# EAGLE design modular_expansion_system_floppy_emulator (EAGLE 9.2.1)
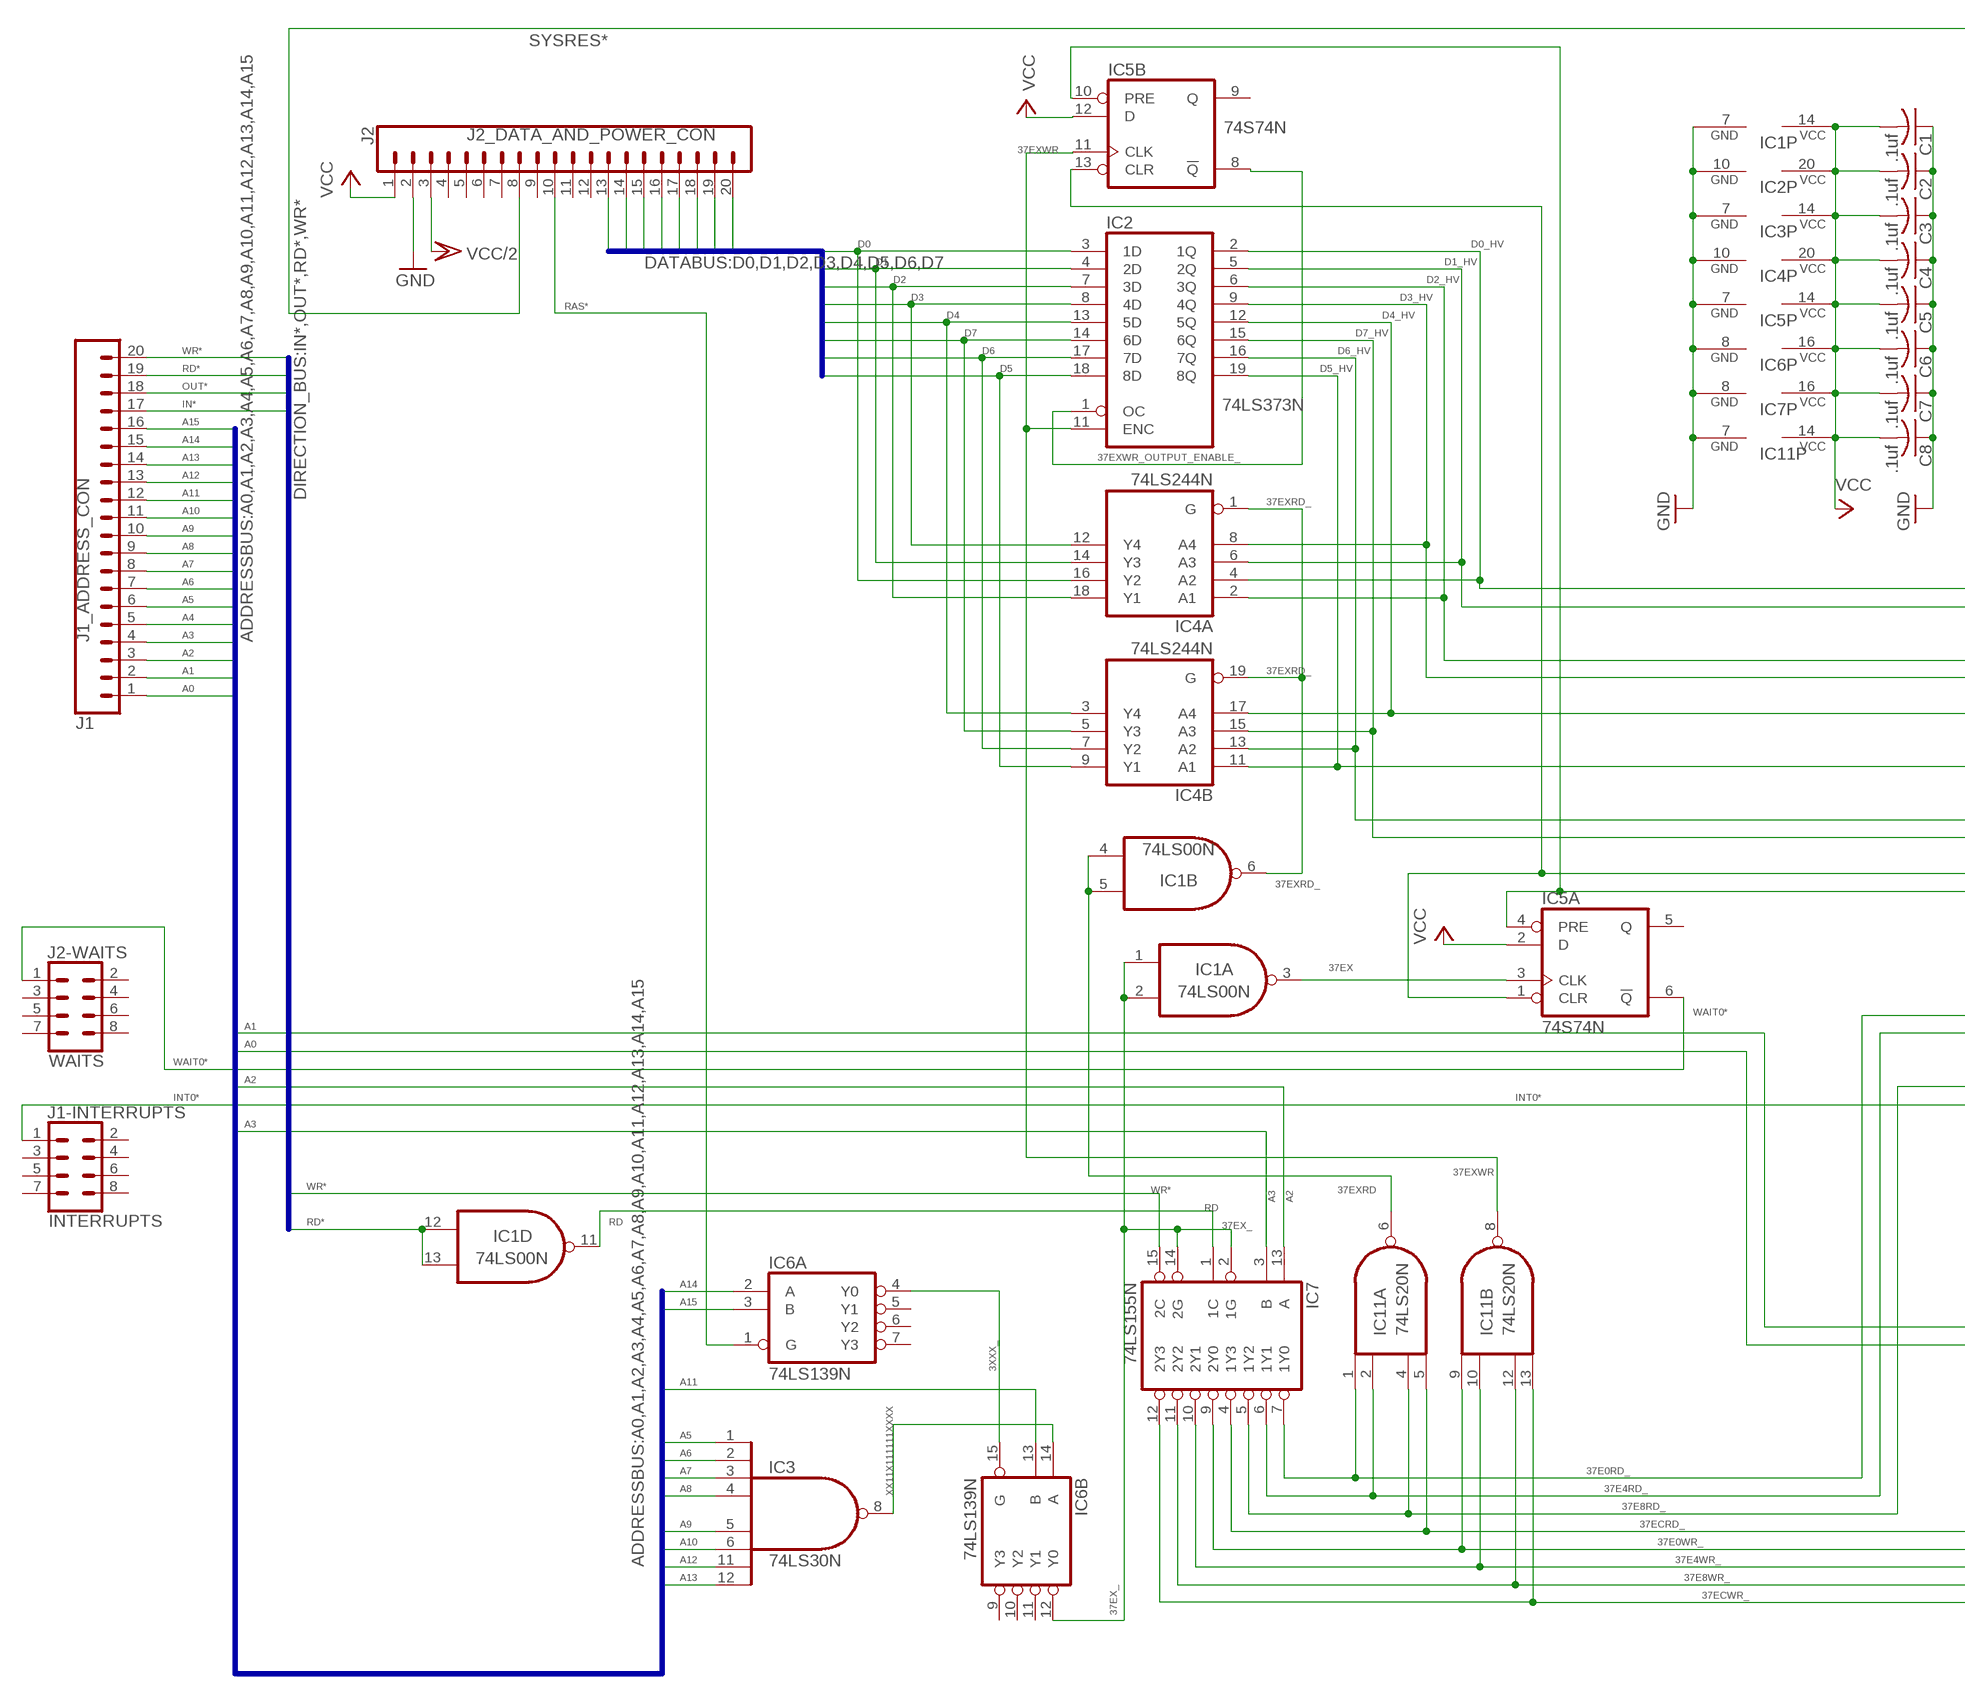
[diagram p0: schematic, sheet 1, part 1 of 2]
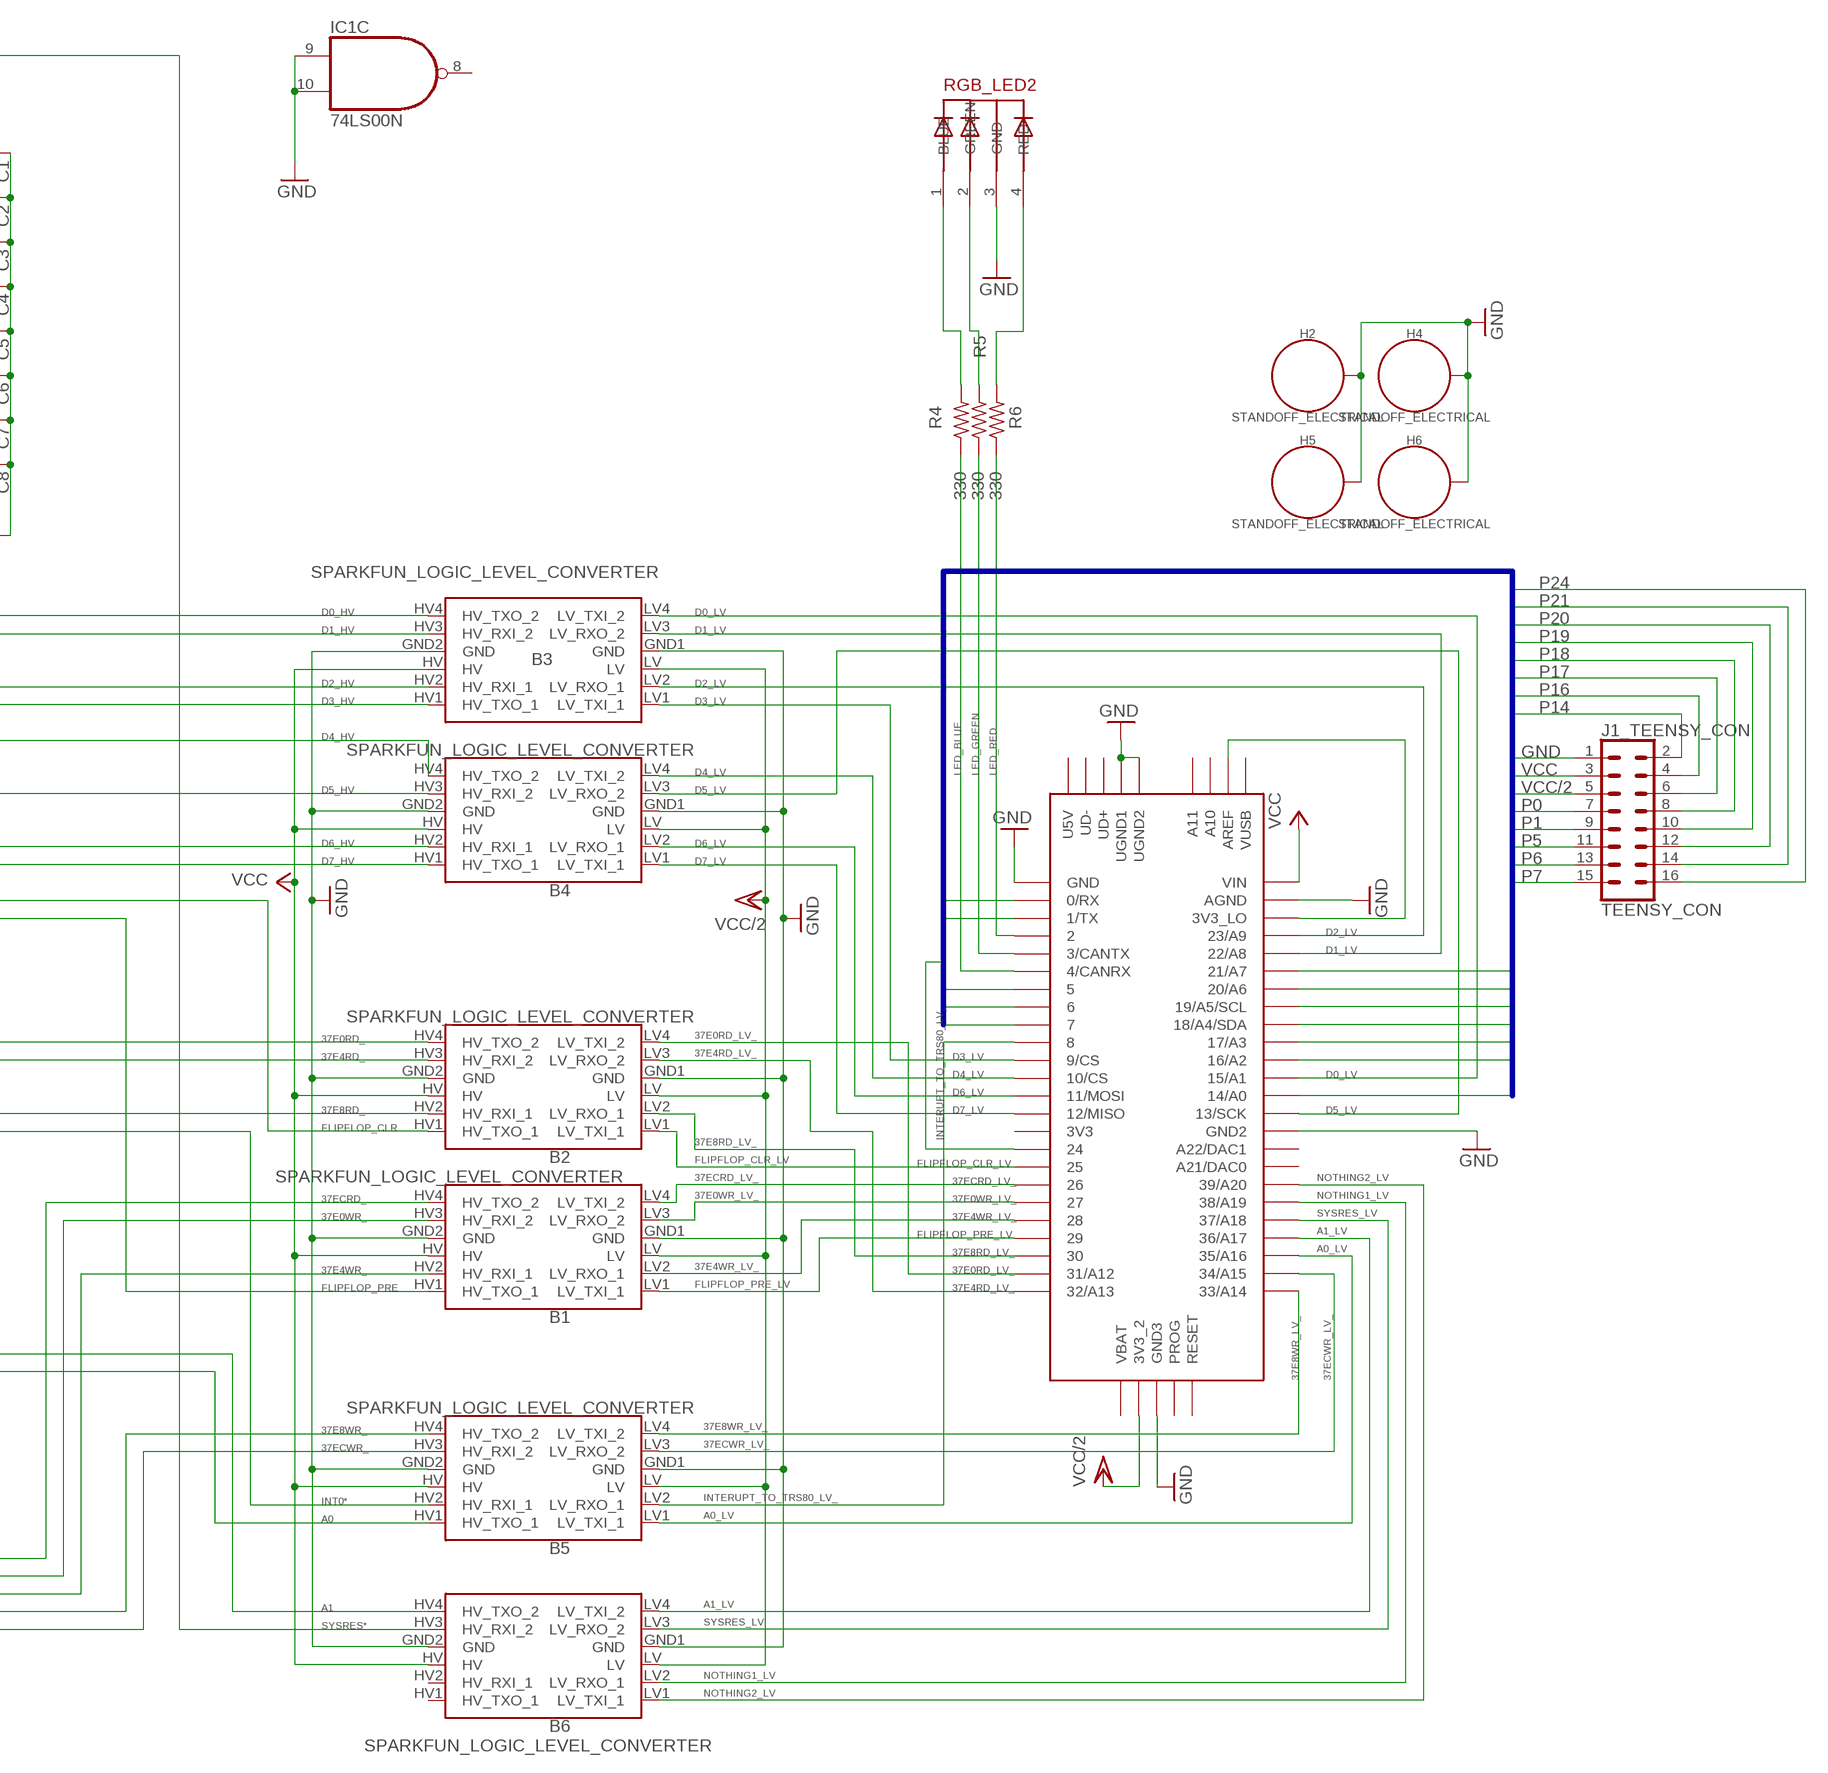
[diagram p1: schematic, sheet 1, part 2 of 2]

## Parts
B1  SPARKFUN_LOGIC_LEVEL_CONVERTER  [SPARKFUN_LOGIC_LEVEL_CONVERTER]
B2  SPARKFUN_LOGIC_LEVEL_CONVERTER  [SPARKFUN_LOGIC_LEVEL_CONVERTER]
B3  SPARKFUN_LOGIC_LEVEL_CONVERTER  [SPARKFUN_LOGIC_LEVEL_CONVERTER]
B4  SPARKFUN_LOGIC_LEVEL_CONVERTER  [SPARKFUN_LOGIC_LEVEL_CONVERTER]
B5  SPARKFUN_LOGIC_LEVEL_CONVERTER  [SPARKFUN_LOGIC_LEVEL_CONVERTER]
B6  SPARKFUN_LOGIC_LEVEL_CONVERTER  [SPARKFUN_LOGIC_LEVEL_CONVERTER]
C1  .1uf  C-US025-024X044  [C025-024X044]
C2  .1uf  C-US025-024X044  [C025-024X044]
C3  .1uf  C-US025-024X044  [C025-024X044]
C4  .1uf  C-US025-024X044  [C025-024X044]
C5  .1uf  C-US025-024X044  [C025-024X044]
C6  .1uf  C-US025-024X044  [C025-024X044]
C7  .1uf  C-US025-024X044  [C025-024X044]
C8  .1uf  C-US025-024X044  [C025-024X044]
H2  STANDOFF_ELECTRICAL  [STANDOFF-ELECTRICAL]
H4  STANDOFF_ELECTRICAL  [STANDOFF-ELECTRICAL]
H5  STANDOFF_ELECTRICAL  [STANDOFF-ELECTRICAL]
H6  STANDOFF_ELECTRICAL  [STANDOFF-ELECTRICAL]
IC1  74LS00N  [DIL14]
IC2  74LS373N  [DIL20]
IC3  74LS30N  [DIL14]
IC4  74LS244N  [DIL20]
IC5  74S74N  [DIL14]
IC6  74LS139N  [DIL16]
IC7  74LS155N  [DIL16]
IC11  74LS20N  [DIL14]
J1-INTERRUPTS  INTERRUPTS  CONN_04X2  [2X4]
J1_ADDRESS_CON  J1  CONN_20  [1X20]
J1_TEENSY_CON  TEENSY_CON  CONN_08X2  [2X8]
J2-WAITS  WAITS  CONN_04X2  [2X4]
J2_DATA_AND_POWER_CON  J2  CONN_20  [1X20]
R4  330  R-US_0204/2V  [0204V]
R5  330  R-US_0204/2V  [0204V]
R6  330  R-US_0204/2V  [0204V]
RGB_LED2  5MMRGBLED  [LED5MMRGB]
U$2  TEENSY_3.5/3.6  [TEENSY_3.5/3.6]

## Nets
3XXX_: IC6.4(A:Y0) IC6.15(B:G)
37E0RD_: B2.HV4(HV_TXO_2) IC7.7(1Y0) IC11.1(A:I0)
37E0RD_LV_: B2.LV4(LV_TXI_2) U$2.31/A12
37E0WR_: B1.HV3(HV_RXI_2) IC7.9(2Y0) IC11.9(B:I0)
37E0WR_LV_: B1.LV3(LV_RXO_2) U$2.27
37E4RD_: B2.HV3(HV_RXI_2) IC7.6(1Y1) IC11.2(A:I1)
37E4RD_LV_: B2.LV3(LV_RXO_2) U$2.32/A13
37E4WR_: B1.HV2(HV_RXI_1) IC7.10(2Y1) IC11.10(B:I1)
37E4WR_LV_: B1.LV2(LV_RXO_1) U$2.28
37E8RD_: B2.HV2(HV_RXI_1) IC7.5(1Y2) IC11.4(A:I2)
37E8RD_LV_: B2.LV2(LV_RXO_1) U$2.30
37E8WR_: B5.HV4(HV_TXO_2) IC7.11(2Y2) IC11.12(B:I2)
37E8WR_LV_: B5.LV4(LV_TXI_2) U$2.33/A14
37ECRD_: B1.HV4(HV_TXO_2) IC7.4(1Y3) IC11.5(A:I3)
37ECRD_LV_: B1.LV4(LV_TXI_2) U$2.26
37ECWR_: B5.HV3(HV_RXI_2) IC7.12(2Y3) IC11.13(B:I3)
37ECWR_LV_: B5.LV3(LV_RXO_2) U$2.34/A15
37EX: IC1.3(A:O) IC5.3(A:CLK)
37EX_: IC1.1(A:I0) IC1.2(A:I1) IC6.12(B:Y0) IC7.2(1G) IC7.14(2G)
37EXRD: IC1.4(B:I0) IC1.5(B:I1) IC11.6(A:O)
37EXRD_: IC1.6(B:O) IC4.1(A:G) IC4.19(B:G)
37EXWR: IC2.11(ENC) IC5.11(B:CLK) IC11.8(B:O)
37EXWR_OUTPUT_ENABLE_: IC2.1(OC) IC5.8(B:!Q)
A0: B5.HV1(HV_TXO_1) J1_ADDRESS_CON.1
A0_LV: B5.LV1(LV_TXI_1) U$2.35/A16
A1: B6.HV4(HV_TXO_2) J1_ADDRESS_CON.2
A1_LV: B6.LV4(LV_TXI_2) U$2.36/A17
A2: IC7.13(A) J1_ADDRESS_CON.3
A3: IC7.3(B) J1_ADDRESS_CON.4
A4: J1_ADDRESS_CON.5
A5: IC3.1(I0) J1_ADDRESS_CON.6
A6: IC3.2(I1) J1_ADDRESS_CON.7
A7: IC3.3(I2) J1_ADDRESS_CON.8
A8: IC3.4(I3) J1_ADDRESS_CON.9
A9: IC3.5(I4) J1_ADDRESS_CON.10
A10: IC3.6(I5) J1_ADDRESS_CON.11
A11: IC6.13(B:B) J1_ADDRESS_CON.12
A12: IC3.11(I6) J1_ADDRESS_CON.13
A13: IC3.12(I7) J1_ADDRESS_CON.14
A14: IC6.2(A:A) J1_ADDRESS_CON.15
A15: IC6.3(A:B) J1_ADDRESS_CON.16
D0: IC2.3(1D) IC4.16(A:Y2) J2_DATA_AND_POWER_CON.20
D0_HV: B3.HV4(HV_TXO_2) IC2.2(1Q) IC4.4(A:A2)
D0_LV: B3.LV4(LV_TXI_2) U$2.15/A1
D1: IC2.4(2D) IC4.14(A:Y3) J2_DATA_AND_POWER_CON.19
D1_HV: B3.HV3(HV_RXI_2) IC2.5(2Q) IC4.6(A:A3)
D1_LV: B3.LV3(LV_RXO_2) U$2.22/A8
D2: IC2.7(3D) IC4.18(A:Y1) J2_DATA_AND_POWER_CON.18
D2_HV: B3.HV2(HV_RXI_1) IC2.6(3Q) IC4.2(A:A1)
D2_LV: B3.LV2(LV_RXO_1) U$2.23/A9
D3: IC2.8(4D) IC4.12(A:Y4) J2_DATA_AND_POWER_CON.17
D3_HV: B3.HV1(HV_TXO_1) IC2.9(4Q) IC4.8(A:A4)
D3_LV: B3.LV1(LV_TXI_1) U$2.9/CS
D4: IC2.13(5D) IC4.3(B:Y4) J2_DATA_AND_POWER_CON.16
D4_HV: B4.HV4(HV_TXO_2) IC2.12(5Q) IC4.17(B:A4)
D4_LV: B4.LV4(LV_TXI_2) U$2.10/CS
D5: IC2.18(8D) IC4.9(B:Y1) J2_DATA_AND_POWER_CON.15
D5_HV: B4.HV3(HV_RXI_2) IC2.19(8Q) IC4.11(B:A1)
D5_LV: B4.LV3(LV_RXO_2) U$2.13/SCK
D6: IC2.17(7D) IC4.7(B:Y2) J2_DATA_AND_POWER_CON.14
D6_HV: B4.HV2(HV_RXI_1) IC2.16(7Q) IC4.13(B:A2)
D6_LV: B4.LV2(LV_RXO_1) U$2.11/MOSI
D7: IC2.14(6D) IC4.5(B:Y3) J2_DATA_AND_POWER_CON.13
D7_HV: B4.HV1(HV_TXO_1) IC2.15(6Q) IC4.15(B:A3)
D7_LV: B4.LV1(LV_TXI_1) U$2.12/MISO
FLIPFLOP_CLR: B2.HV1(HV_TXO_1) IC5.1(A:CLR) IC5.13(B:CLR)
FLIPFLOP_CLR_LV: B2.LV1(LV_TXI_1) U$2.25
FLIPFLOP_PRE: B1.HV1(HV_TXO_1) IC5.4(A:PRE) IC5.10(B:PRE)
FLIPFLOP_PRE_LV: B1.LV1(LV_TXI_1) U$2.29
GND: B1.GND1(GND) B1.GND2(GND) B2.GND1(GND) B2.GND2(GND) B3.GND1(GND) B3.GND2(GND) B4.GND1(GND) B4.GND2(GND) B5.GND1(GND) B5.GND2(GND) B6.GND1(GND) B6.GND2(GND) C1.1 C2.1 C3.1 C4.1 C5.1 C6.1 C7.1 C8.1 H2.P1 H4.P1 H5.P1 H6.P1 IC1.7(P:GND) IC1.9(C:I0) IC1.10(C:I1) IC2.10(GND) IC3.7(GND) IC4.10(P:GND) IC5.7(P:GND) IC6.8(P:GND) IC7.8(GND) IC11.7(P:GND) J1_TEENSY_CON.1 J2_DATA_AND_POWER_CON.2 RGB_LED2.3(GND) U$2.AGND U$2.GND U$2.GND2 U$2.GND3 U$2.UGND1 U$2.UGND2
IN*: J1_ADDRESS_CON.17
INT0*: B5.HV2(HV_RXI_1) J1-INTERRUPTS.1
INTERUPT_TO_TRS80_LV_: B5.LV2(LV_RXO_1) U$2.8
LED_BLUE: R4.1 U$2.4/CANRX
LED_GREEN: R5.1 U$2.3/CANTX
LED_RED: R6.1 U$2.2
N$1: U$2.3V3_LO U$2.AREF
N$2: R5.2 RGB_LED2.2(GREEN)
N$19: R4.2 RGB_LED2.1(BLUE)
N$21: R6.2 RGB_LED2.4(RED)
NOTHING1_LV: B6.LV2(LV_RXO_1) U$2.38/A19
NOTHING2_LV: B6.LV1(LV_TXI_1) U$2.39/A20
OUT*: J1_ADDRESS_CON.18
P0: J1_TEENSY_CON.7 U$2.0/RX
P1: J1_TEENSY_CON.9 U$2.1/TX
P5: J1_TEENSY_CON.11 U$2.5
P6: J1_TEENSY_CON.13 U$2.6
P7: J1_TEENSY_CON.15 U$2.7
P14: J1_TEENSY_CON.2 U$2.14/A0
P16: J1_TEENSY_CON.4 U$2.16/A2
P17: J1_TEENSY_CON.6 U$2.17/A3
P18: J1_TEENSY_CON.8 U$2.18/A4/SDA
P19: J1_TEENSY_CON.10 U$2.19/A5/SCL
P20: J1_TEENSY_CON.12 U$2.20/A6
P21: J1_TEENSY_CON.14 U$2.21/A7
P24: J1_TEENSY_CON.16 U$2.24
RAS*: IC6.1(A:G) J2_DATA_AND_POWER_CON.10
RD: IC1.11(D:O) IC7.1(1C)
RD*: IC1.12(D:I0) IC1.13(D:I1) J1_ADDRESS_CON.19
SYSRES*: B6.HV3(HV_RXI_2) J2_DATA_AND_POWER_CON.8
SYSRES_LV: B6.LV3(LV_RXO_2) U$2.37/A18
VCC: B1.HV B2.HV B3.HV B4.HV B5.HV B6.HV C1.2 C2.2 C3.2 C4.2 C5.2 C6.2 C7.2 C8.2 IC1.14(P:VCC) IC2.20(VCC) IC3.14(VCC) IC4.20(P:VCC) IC5.2(A:D) IC5.12(B:D) IC5.14(P:VCC) IC6.16(P:VCC) IC7.16(VCC) IC11.14(P:VCC) J1_TEENSY_CON.3 J2_DATA_AND_POWER_CON.1 U$2.VIN
VCC/2: B1.LV B2.LV B3.LV B4.LV B5.LV B6.LV J1_TEENSY_CON.5 J2_DATA_AND_POWER_CON.3 U$2.3V3_2
WAIT0*: IC5.6(A:!Q) J2-WAITS.1
WR*: IC7.15(2C) J1_ADDRESS_CON.20
XX11X111111XXXX: IC3.8(O) IC6.14(B:A)
Unconnected: B6.HV1(HV_TXO_1) B6.HV2(HV_RXI_1) IC1.8(C:O) IC5.5(A:Q) IC5.9(B:Q) IC6.5(A:Y1) IC6.6(A:Y2) IC6.7(A:Y3) IC6.9(B:Y3) IC6.10(B:Y2) IC6.11(B:Y1) J1-INTERRUPTS.2 J1-INTERRUPTS.3 J1-INTERRUPTS.4 J1-INTERRUPTS.5 J1-INTERRUPTS.6 J1-INTERRUPTS.7 J1-INTERRUPTS.8 J2-WAITS.2 J2-WAITS.3 J2-WAITS.4 J2-WAITS.5 J2-WAITS.6 J2-WAITS.7 J2-WAITS.8 J2_DATA_AND_POWER_CON.4 J2_DATA_AND_POWER_CON.5 J2_DATA_AND_POWER_CON.6 J2_DATA_AND_POWER_CON.7 J2_DATA_AND_POWER_CON.9 J2_DATA_AND_POWER_CON.11 J2_DATA_AND_POWER_CON.12 U$2.3V3 U$2.21/DAC0(A21/DAC0) U$2.A10 U$2.A11 U$2.A22/DAC1 U$2.PROG U$2.RESET U$2.U5V U$2.UD+ U$2.UD- U$2.VBAT U$2.VUSB

## Buses
ADDRESSBUS:A0,A1,A2,A3,A4,A5,A6,A7,A8,A9,A10,A11,A12,A13,A14,A15
DIRECTION_BUS:IN*,OUT*,RD*,WR*
DATABUS:D0,D1,D2,D3,D4,D5,D6,D7
TEENSY_UNUSED:GND,P0,P1,P5,P6,P7,P14,P16,P17,P18,P19,P20,P21,P24,VCC,VCC/2

## Library data of the parts
B1-B6 = SparkFun-Boards:SPARKFUN_LOGIC_LEVEL_CONVERTER: SparkFun Logic Level Converter -Bi-Directional This is the mechnical outline for the 3.3V - 5V bi directional logic level converter. *Note, the "LOCK" Package has the header pins staggered by an offset of 5 mils (off center line), so that when you slide a row of standard 0.1" headers into the PTH pads, it will hold position vertically. See the follwing turorial for more information on this type of special footprints: Sneaky Footprints <https://www.sparkfun.com/tutorials/114> SparkFun Products: SparkFun Logic Level Converter - Bi-Directional <https://www.sparkfun.com/products/12009>
C1-C8 = rcl:C-US: CAPACITOR, American symbol; SPICEPREFIX: C
H2 H4-H6 = SparkFun-Hardware:STANDOFF_ELECTRICAL: Stand Off Drill holes with an electrical connection. For example, use these to ground your board to a chassis. Example SparkFun Products Screw - Phillips Head (1/4", 4-40, 10 pack) <https://www.sparkfun.com/products/10453> (PRT-10453) Screw - Phillips Head (1/2", 4-40, 10 pack) <https://www.sparkfun.com/products/10452> (PRT-10452) Screw - Phillips Head (3/4", 4-40, 10 pack) <https://www.sparkfun.com/products/10451> (PRT-10451) Screw - Phillips Head (1", 4-40, 10 pack) <https://www.sparkfun.com/products/10450> (PRT-10450)
IC1 = 74xx-us:74*00: Quad 2-input NAND gate
IC2 = 74xx-us:74*373: Octal D type transparent LATCH, edge triggered
IC3 = 74xx-us:74*30: 8-input NAND gate
IC4 = 74xx-us:74*244: Octal BUFFER and LINE DRIVER, 3-state
IC5 = 74xx-us:74*74: Dual D type positive edge triggered FLIP FLOP, preset and clear
IC6 = 74xx-us:74*139: Dual 2-line to 4-line DECODER/DEMULTIPLEXER
IC7 = 74xx-us:74*155: Dual 2-line to 4-line data DECODER/DEMULTIPLEXER
IC11 = 74xx-us:74*20: Dual 4-input NAND gate
J1-INTERRUPTS J2-WAITS = SparkFun-Connectors:CONN_04X2: Multi connection point. Often used as Generic Header-pin footprint for 0.1 inch spaced/style header connections On any of the 0.1 inch spaced packages, you can populate with these: Break Away Headers - Straight <https://www.sparkfun.com/products/116> (PRT-00116) Break Away Male Headers - Right Angle <https://www.sparkfun.com/products/553> (PRT-00553) Female Headers <https://www.sparkfun.com/products/115> (PRT-00115) Break Away Headers - Machine Pin <https://www.sparkfun.com/products/117> (PRT-00117) Break Away Female Headers - Swiss Machine Pin <https://www.sparkfun.com/products/743> (PRT-00743)
J1_ADDRESS_CON J2_DATA_AND_POWER_CON = SparkFun-Connectors:CONN_20: Multi connection point. Often used as Generic Header-pin footprint for 0.1 inch spaced/style header connections On any of the 0.1 inch spaced packages, you can populate with these: Break Away Headers - Straight <https://www.sparkfun.com/products/116> (PRT-00116) Break Away Male Headers - Right Angle <https://www.sparkfun.com/products/553> (PRT-00553) Female Headers <https://www.sparkfun.com/products/115> (PRT-00115) Break Away Headers - Machine Pin <https://www.sparkfun.com/products/117> (PRT-00117) Break Away Female Headers - Swiss Machine Pin <https://www.sparkfun.com/products/743> (PRT-00743) For SCREWTERMINALS and SPRING TERMINALS visit here: Screw Terimnals on SparkFun.com <https://www.sparkfun.com/search/results?term=Screw+Terminals> (5mm/3.5mm/2.54mm spacing) This device is also useful as a general connection point to wire up your design to another part of your project. Our various solder wires solder well into these plated through hole pads. Hook-Up Wire - Assortment (Stranded, 22 AWG) <https://www.sparkfun.com/products/11375> (PRT-11375) Hook-Up Wire - Assortment (Solid Core, 22 AWG) <https://www.sparkfun.com/products/11367> (PRT-11367) View the entire wire category on our website here <https://www.sparkfun.com/categories/141> Special notes: Molex polarized connector foot print use with SKU : PRT-08231 with associated crimp pins and housings. 1MM SMD Version SKU: PRT-10208 NOTES ON THE VARIANTS LOCK and LOCK_LONGPADS... This footprint was designed to help hold the alignment of a through-hole component (i.e. 6-pin header) while soldering it into place. You may notice that each hole has been shifted either up or down by 0.005 of an inch from it's more standard position (which is a perfectly straight line). This slight alteration caused the pins (the squares in the middle) to touch the edges of the holes. Because they are alternating, it causes a "brace" to hold the component in place. 0.005 has proven to be the perfect amount of "off-center" position when using our standard breakaway headers. Although looks a little odd when you look at the bare footprint, once you have a header in there, the alteration is very hard to notice. Also,if you push a header all the way into place, it is covered up entirely on the bottom side. Note about LOCK SPECIAL package: This is just like the LOCK variant in that the holes are staggared by 5 mil, but except for the last two holes. They are not altered from the "standard" footprint layout. This is used for a special purpose on the layout of our Graphic LCD Backpack. Make sure you want to use this device before selecting it for you project!
J1_TEENSY_CON = SparkFun-Connectors:CONN_08X2: Multi connection point. Often used as Generic Header-pin footprint for 0.1 inch spaced/style header connections You can populate with any combo of single row headers, but if you'd like an exact match, check this: Header - 2x8 (Male, 0.1") <https://www.sparkfun.com/products/13156> (PRT-13156) On any of the 0.1 inch spaced packages, you can populate with these: Break Away Headers - Straight <https://www.sparkfun.com/products/116> (PRT-00116) Break Away Male Headers - Right Angle <https://www.sparkfun.com/products/553> (PRT-00553) Female Headers <https://www.sparkfun.com/products/115> (PRT-00115) Break Away Headers - Machine Pin <https://www.sparkfun.com/products/117> (PRT-00117) Break Away Female Headers - Swiss Machine Pin <https://www.sparkfun.com/products/743> (PRT-00743)
R4-R6 = resistor:R-US_: RESISTOR, American symbol
RGB_LED2 = adafruit:5MMRGBLED
U$2 = Teensy356:TEENSY_3.5/3.6

## Net classes
0 default: width 0.3 mm, clearance 0.05 mm

## Board
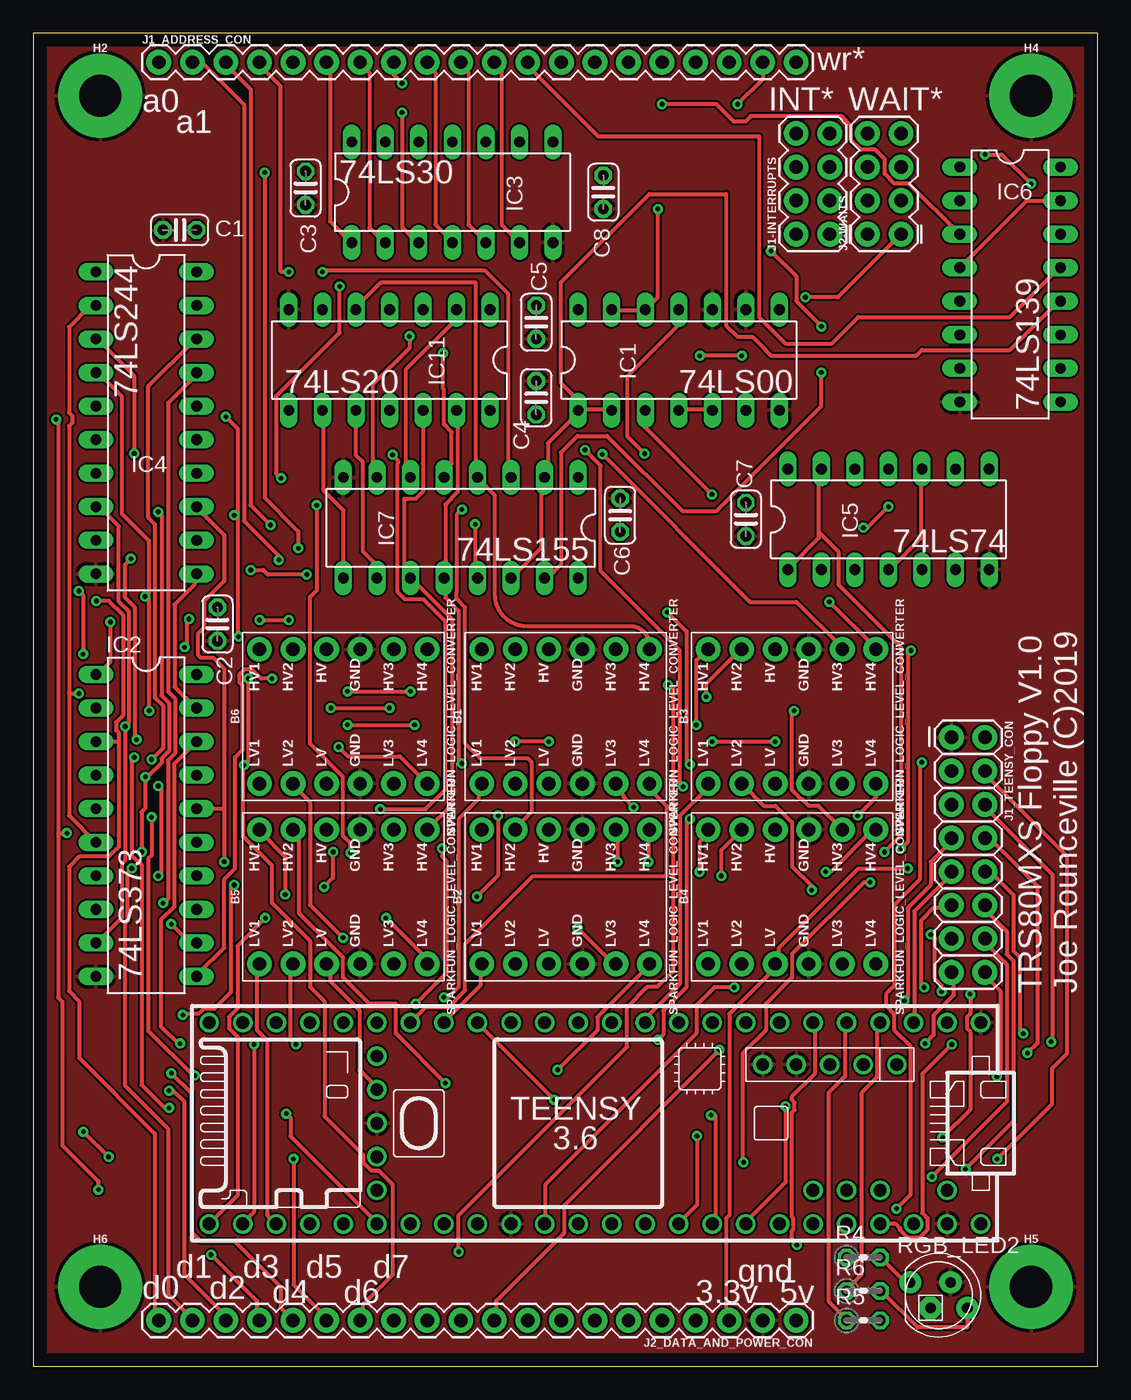
[diagram p2: board, top side]
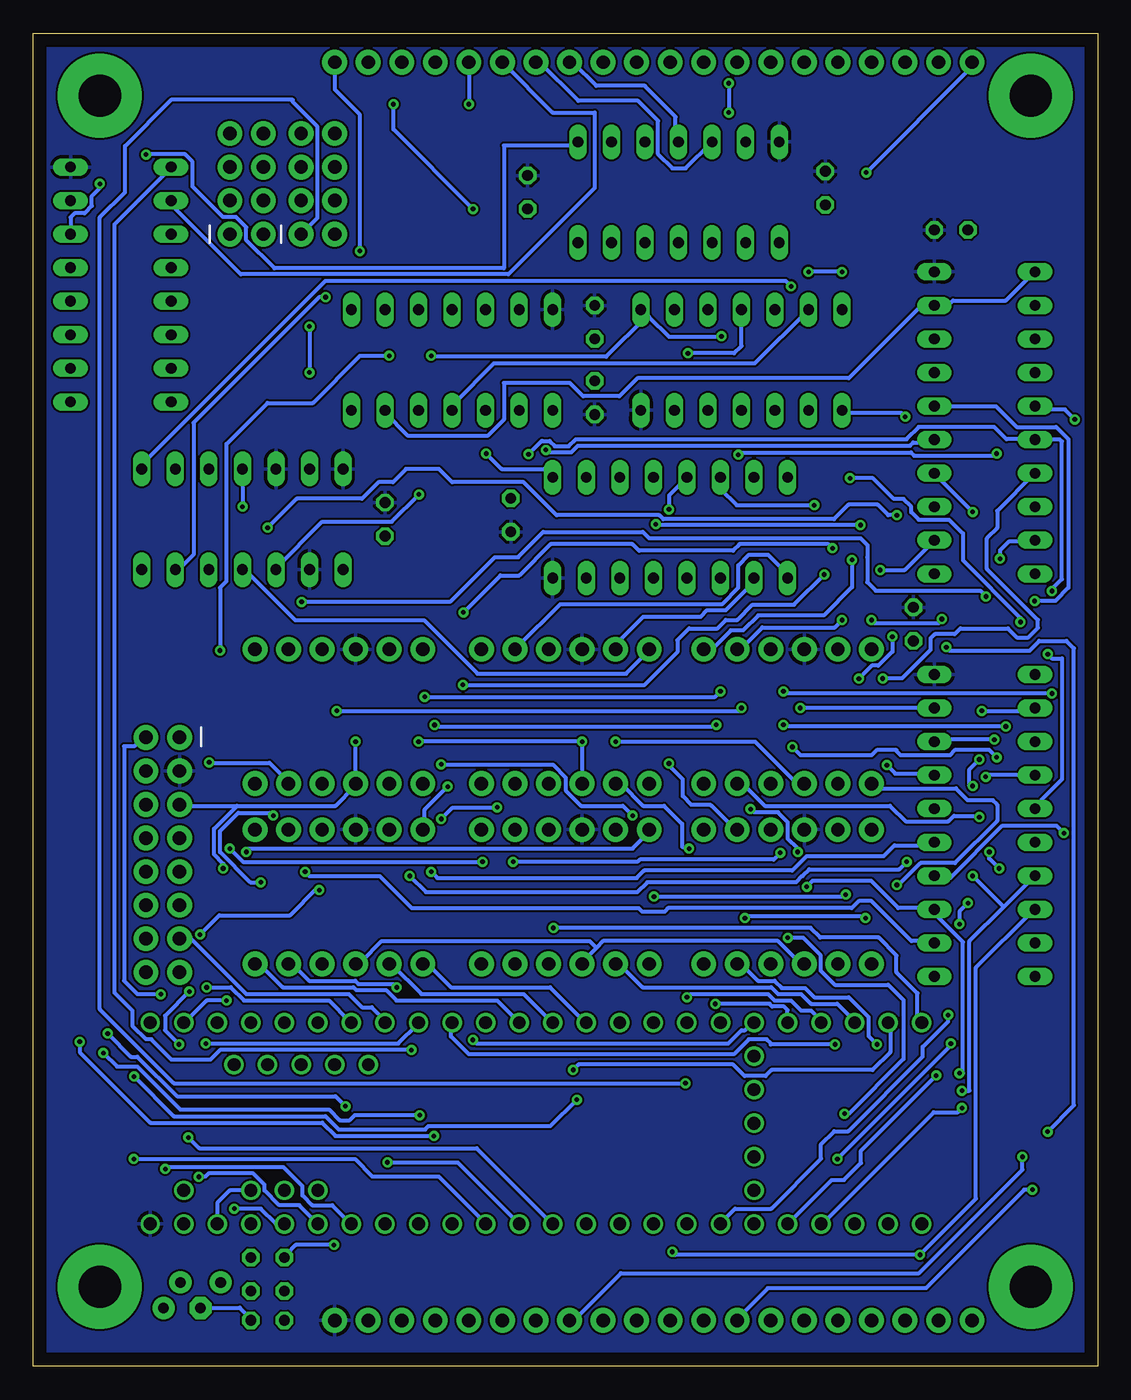
[diagram p3: board, bottom side, seen from below]

Size 80.62 x 100.95 mm. Coordinates in mm from the lower left corner, seen from the top.
Outline: 0,0 80.62,0 80.62,100.95 0,100.95 0,0
Copper layers (1*16): Top 0.035mm / dielectric 1.5mm / Bottom 0.035mm
Design rules "default": minimum track width 6mil, minimum drill 0.35mm, track to track 6mil, track to pad 6mil, pad to pad 6mil, via to via 6mil, smd to smd 6mil, copper to edge 40mil, drill to drill 6mil, minimum pad ring 10mil, minimum via ring 8mil, stop-mask expansion 4mil, vias tented up to drill 0mil, thermal gap 10mil

### Footprints (pad centres in the part's own frame; a part is rotated, then mirrored left to right if it is on the bottom)
SPARKFUN_LOGIC_LEVEL_CONVERTER = drill 1.016 pad 1.88: GND1 -5.08,-1.27; GND2 5.08,-1.27; HV 5.08,1.27; HV1 5.08,6.35; HV2 5.08,3.81; HV3 5.08,-3.81; HV4 5.08,-6.35; LV -5.08,1.27; LV1 -5.08,6.35; LV2 -5.08,3.81; LV3 -5.08,-3.81; LV4 -5.08,-6.35
C025-024X044 = drill 0.813 octagon: 1 -1.27,0; 2 1.27,0
STANDOFF-ELECTRICAL = drill 3.2 pad 6.35: P1 0,0
DIL14 = drill 0.813 long: 1 -7.62,-3.81; 2 -5.08,-3.81; 3 -2.54,-3.81; 4 0,-3.81; 5 2.54,-3.81; 6 5.08,-3.81; 7 7.62,-3.81; 8 7.62,3.81; 9 5.08,3.81; 10 2.54,3.81; 11 0,3.81; 12 -2.54,3.81; 13 -5.08,3.81; 14 -7.62,3.81
DIL20 = drill 0.813 long: 1 -11.43,-3.81; 2 -8.89,-3.81; 3 -6.35,-3.81; 4 -3.81,-3.81; 5 -1.27,-3.81; 6 1.27,-3.81; 7 3.81,-3.81; 8 6.35,-3.81; 9 8.89,-3.81; 10 11.43,-3.81; 11 11.43,3.81; 12 8.89,3.81; 13 6.35,3.81; 14 3.81,3.81; 15 1.27,3.81; 16 -1.27,3.81; 17 -3.81,3.81; 18 -6.35,3.81; 19 -8.89,3.81; 20 -11.43,3.81
DIL16 = drill 0.813 long: 1 -8.89,-3.81; 2 -6.35,-3.81; 3 -3.81,-3.81; 4 -1.27,-3.81; 5 1.27,-3.81; 6 3.81,-3.81; 7 6.35,-3.81; 8 8.89,-3.81; 9 8.89,3.81; 10 6.35,3.81; 11 3.81,3.81; 12 1.27,3.81; 13 -1.27,3.81; 14 -3.81,3.81; 15 -6.35,3.81; 16 -8.89,3.81
2X4 = drill 1.016 pad 1.88: 1 -3.81,-1.27; 2 -3.81,1.27; 3 -1.27,-1.27; 4 -1.27,1.27; 5 1.27,-1.27; 6 1.27,1.27; 7 3.81,-1.27; 8 3.81,1.27
1X20 = drill 1.016 pad 1.88: 1 0,0; 2 2.54,0; 3 5.08,0; 4 7.62,0; 5 10.16,0; 6 12.7,0; 7 15.24,0; 8 17.78,0; 9 20.32,0; 10 22.86,0; 11 25.4,0; 12 27.94,0; 13 30.48,0; 14 33.02,0; 15 35.56,0; 16 38.1,0; 17 40.64,0; 18 43.18,0; 19 45.72,0; 20 48.26,0
2X8 = drill 1.016 pad 1.88: 1 0,0; 2 0,2.54; 3 2.54,0; 4 2.54,2.54; 5 5.08,0; 6 5.08,2.54; 7 7.62,0; 8 7.62,2.54; 9 10.16,0; 10 10.16,2.54; 11 12.7,0; 12 12.7,2.54; 13 15.24,0; 14 15.24,2.54; 15 17.78,0; 16 17.78,2.54
0204V = drill 0.813 octagon: 1 -1.27,0; 2 1.27,0
LED5MMRGB = drill 0.8 pad 1.676: 1 -2.159,0.968; 3 0.889,0.968; 4 2.159,-0.968 | drill 0.8 pad 1.676 octagon: 2 -0.635,-0.968
TEENSY_3.5/3.6 = drill 0.965: 0/RX -25.4,-7.62; 1/TX -22.86,-7.62; 2 -20.32,-7.62; 3/CANTX -17.78,-7.62; 3V3 7.62,-7.62; 3V3_2 17.78,-2.54; 3V3_LO -22.86,7.62; 4/CANRX -15.24,-7.62; 5 -12.7,-7.62; 6 -10.16,-7.62; 7 -7.62,-7.62; 8 -5.08,-7.62; 9/CS -2.54,-7.62; 10/CS 0,-7.62; 11/MOSI 2.54,-7.62; 12/MISO 5.08,-7.62; 13/SCK 5.08,7.62; 14/A0 2.54,7.62; 15/A1 0,7.62; 16/A2 -2.54,7.62; 17/A3 -5.08,7.62; 18/A4/SDA -7.62,7.62; 19/A5/SCL -10.16,7.62; 20/A6 -12.7,7.62; 21/A7 -15.24,7.62; 21/DAC0 12.7,7.62; 22/A8 -17.78,7.62; 23/A9 -20.32,7.62; 24 10.16,-7.62; 25 12.7,-7.62; 26 15.24,-7.62; 27 17.78,-7.62; 28 20.32,-7.62; 29 22.86,-7.62; 30 25.4,-7.62; 31/A12 27.94,-7.62; 32/A13 30.48,-7.62; 33/A14 30.48,7.62; 34/A15 27.94,7.62; 35/A16 25.4,7.62; 36/A17 22.86,7.62; 37/A18 20.32,7.62; 38/A19 17.78,7.62; 39/A20 15.24,7.62; A10 -17.78,5.08; A11 -15.24,5.08; A22/DAC1 10.16,7.62; AGND -25.4,7.62; AREF -20.32,5.08; GND -27.94,-7.62; GND2 7.62,7.62; GND3 17.78,0; PROG 17.78,2.54; RESET 17.78,5.08; U5V -21.59,-4.445; UD+ -16.51,-4.445; UD- -19.05,-4.445; UGND1 -13.97,-4.445; UGND2 -11.43,-4.445; VBAT 17.78,-5.08; VIN -27.94,7.62; VUSB -25.4,5.08

### Placement (x,y rotation side)
B1  40.32,49.21 90 top
B2  40.32,35.56 90 top
B3  57.47,49.21 90 top
B4  57.47,35.56 90 top
B5  23.5,35.56 90 top
B6  23.5,49.21 90 top
C1  11.11,86.04 0 top
C2  13.97,56.2 90 top
C3  20.64,89.22 90 top
C4  38.1,73.34 270 top
C5  38.1,79.06 90 top
C6  44.45,64.45 270 top
C7  53.97,64.14 90 top
C8  43.18,88.9 90 top
H2  5.08,96.2 0 top
H4  75.56,96.2 0 top
H5  75.56,6.03 0 top
H6  5.08,6.03 0 top
IC1  48.89,76.2 0 top
IC2  8.57,40.96 270 top
IC3  31.75,88.9 0 top
IC4  8.57,71.44 270 top
IC5  64.77,64.14 0 top
IC6  73.98,81.92 270 top
IC7  32.38,63.5 180 top
IC11  26.99,76.2 180 top
J1-INTERRUPTS  59.05,89.53 90 top
J1_ADDRESS_CON  9.52,98.74 0 top
J1_TEENSY_CON  69.53,47.62 270 top
J2-WAITS  64.45,89.53 90 top
J2_DATA_AND_POWER_CON  57.78,3.49 180 top
R4  62.86,8.26 0 top
R5  62.86,3.49 0 top
R6  62.86,5.71 0 top
RGB_LED2  68.58,5.4 0 top
U$2  43.81,18.41 180 top

### Tracks (layer width: path | path; a pad name or v marks a point on that pad's centre or on a via)
3XXX_
  Top 0.3: IC6.4 75.25,88.27 IC6.15
37E0RD_  (via drill 0.35)
  Top 0.3: v28.5,78 28.5,77.11 25.73,74.34 25.73,67.7 25.98,67.45 IC7.7 | v46.59,38.2 46.59,40.56 B2.HV4 | v65.73,39.2 66.23,39.7 66.23,53.95 v66.48,54.2 | v53.66,76.52 v50.48,76.52
  Bottom 0.3: v28.5,78 28.5,77.95 32.47,77.95 33.97,79.45 | 33.97,79.45 34.47,79.95 IC11.1 33.97,79.45 | v46.59,38.2 64.73,38.2 v65.73,39.2 | v66.48,54.2 66.48,58.95 65.98,59.45 65.98,69.85 62.87,72.95 59.43,72.95 55.86,76.52 v53.66,76.52 | 33.97,79.45 34.22,79.45 37.22,76.45 50.42,76.45 v50.48,76.52
37E0RD_LV_  (via drill 0.35)
  Top 0.3: v39.72,22.45 42.72,25.45 42.72,26.45 46.47,30.2 46.47,30.45 B2.LV4
  Bottom 0.3: U$2.31/A12 15.73,25.89 15.73,23.79 17.06,22.45 24.71,22.45 25.17,21.99 26.76,21.99 27.62,22.86 39.32,22.86 v39.72,22.45
37E0WR_
  Top 0.3: IC7.9 23.49,64.84 21.98,66.36 21.98,72.2 IC11.9
  Bottom 0.3: B1.HV3 43.97,54.45 40.72,57.7 28.48,57.7 27.23,58.95 27.23,60.64 26.42,61.45 24.98,61.45 23.73,60.2 23.73,59.7 IC7.9
37E0WR_LV_  (via drill 0.35)
  Top 0.3: v47.32,24.73 47.72,25.14 47.72,26.95 49.47,28.7 49.47,41.3 49.63,41.45 v49.72,41.45 | v45.47,42.34 44.72,43.09 44.72,43.2 44.22,43.7 44.22,43.95 B1.LV3
  Bottom 0.3: v47.32,24.73 47.04,24.45 27.98,24.45 26.98,25.45 26.73,25.45 26.23,25.95 U$2.27 | v49.72,41.45 48.91,42.27 45.54,42.27 v45.47,42.34
37E4RD_  (via drill 0.35)
  Top 0.3: IC7.6 28.48,67.45 28.23,67.7 28.23,75.45 31.97,79.2 31.97,79.95 IC11.2 | v21.48,65.2 21.48,58.75 20.98,58.25 20.98,47.15 23.48,44.65 23.48,40.17 24.05,39.6 24.04,39.6 v24.04,38.88 | B2.HV3 44.27,40.51 v44.27,38.2
  Bottom 0.3: v24.04,38.88 24.54,38.38 34.68,38.38 34.86,38.2 v44.27,38.2 | v21.48,65.2 27.34,65.2 28.57,66.44 IC7.6
37E4RD_LV_  (via drill 0.35)
  Top 0.3: v41.22,33.2 43.97,30.45 B2.LV3
  Bottom 0.3: U$2.32/A13 13.65,26.35 13.65,28.26 15.24,29.84 15.24,31.11 16.59,32.46 21.01,32.46 21.75,33.2 v41.22,33.2
37E4WR_
  Top 0.3: IC11.10 24.48,72.2 24.48,68.95 24.98,68.45 24.98,61.7 25.98,60.7 25.98,59.7 IC7.10
  Bottom 0.3: IC7.10 26.23,59.45 26.23,59.2 28.18,57.25 29.59,57.25 30.07,56.77 34.41,56.77 36.72,54.45 B1.HV2
37E4WR_LV_  (via drill 0.35)
  Top 0.3: v28.98,27.45 31.32,29.79 31.32,38.26 30.96,38.62 v30.96,39.21
  Bottom 0.3: B1.LV2 36.11,44.13 34.43,42.45 32.84,42.45 31.48,41.09 31.48,39.34 31.09,39.34 v30.96,39.21 | v28.98,27.45 24.86,27.45 24.66,27.25 23.76,27.25 23.49,26.99 U$2.28
37E8RD_  (via drill 0.35)
  Top 0.3: B2.HV2 36.47,40.7 37.75,41.98 37.75,45.75 37.44,46.06 33.84,46.06 32.72,47.17 32.72,57.48 32.07,58.13 32.07,58.62 32.08,58.63 32.08,64.49 v32.47,64.89 | IC7.5 31.12,67.79 31.71,68.38 31.71,70.73 31.1,71.33 31.1,73.45 31.12,73.46 31.12,73.98 31.04,74.05 v31.04,76.7
  Bottom 0.3: v31.04,76.7 27.55,76.7 26.99,77.27 IC11.4 | IC7.5 32.47,65.95 v32.47,64.89
37E8RD_LV_
  Bottom 0.3: U$2.30 18.48,26.2 19.73,27.45 21.73,27.45 22.48,28.2 24.23,28.2 24.73,28.7 34.47,28.7 36.22,30.45 36.47,30.45 B2.LV2
37E8WR_
  Top 0.3: IC11.12 29.53,68.38 29.54,68.37 29.54,66.25 28.97,65.69 28.1,65.69 28.1,60.16 IC7.11 28.62,59.69 31.72,56.59 31.72,44.13 31.75,44.13 31.75,42.55 B5.HV4
37E8WR_LV_  (via drill 0.35)
  Top 0.3: v17.59,33.95 15.48,31.84 15.48,27.1 14.84,26.46 14.84,25.61 15.48,24.97 15.48,12.95 13.48,10.95 U$2.33/A14 | v26.73,33.95 29.73,30.95 29.73,30.7 B5.LV4
  Bottom 0.3: v26.73,33.95 26.57,34.11 17.75,34.11 v17.59,33.95
37ECRD_
  Top 0.3: IC11.5 24.48,80.2 26.32,82.04 33.54,82.04 33.54,68.39 33.72,68.2 33.72,67.45 IC7.4 33.72,67.2 34.97,65.95 34.97,58.45 arc90 37.39,56.04 45.24,56.04 arc-90 46.67,54.61 B1.HV4
37ECRD_LV_
  Top 0.3: U$2.26 28.73,26.2 29.73,27.2 31.45,27.2 32.72,28.48 32.72,32 37.86,37.13 47.97,37.13 47.97,42.45 46.72,43.7 46.72,43.95 B1.LV4
37ECWR_  (via drill 0.35)
  Top 0.3: IC11.13 32.16,72.28 32.16,66.2 31.23,65.27 31.23,59.7 IC7.12 31.23,59.45 31.23,58.2 32.22,57.2 32.22,45.91 v32.47,45.66
  Bottom 0.3: B5.HV3 27.48,40.7 29.23,42.45 29.27,42.45 29.37,42.55 30.8,42.55 31.43,43.18 31.43,44.45 32.47,45.49 v32.47,45.66
37ECWR_LV_  (via drill 0.35)
  Top 0.3: v16.73,24.39 16.73,11.7 15.98,10.95 U$2.34/A15
  Bottom 0.3: B5.LV3 27.23,30.45 26.98,30.45 25.73,29.2 24.48,29.2 23.93,28.66 22.18,28.66 21.48,27.95 18.86,27.95 17.38,26.46 17.38,25.04 v16.73,24.39
37EX  (via drill 0.35)
  Top 0.3: IC1.3 46.33,72.36 46.33,71.1 v51.41,66.02
  Bottom 0.3: v51.41,66.02 53.47,63.95 58.72,63.95 62.22,60.45 IC5.3
37EX_
  Top 0.3: IC7.14 36.22,59.7 38.47,61.95 38.47,65.95 38.72,66.2 38.72,67.2 IC7.2 38.97,67.45 38.97,69.91 41.22,72.16 41.22,72.2 IC1.1 | IC1.1 41.47,72.45 43.72,72.45 IC1.2 | IC1.1 41.22,72.45 41.22,73.2 39.97,74.45 39.97,82.09 46.66,88.77 52.47,88.77 52.47,78.82 53.34,77.95 54.47,77.95 55.47,76.95 55.47,76.92 55.88,76.52 66.87,76.52 67.31,76.95 73.98,76.95 77.48,80.45 IC6.12
37EXRD
  Top 0.3: IC1.4 48.97,72.45 51.22,72.45 IC1.5
  Bottom 0.3: IC11.6 21.98,79.95 25.98,75.95 45.72,75.95 48.72,72.95 48.72,72.45 IC1.4
37EXRD_
  Bottom 0.3: IC4.1 4.98,82.7 6.98,80.7 10.98,80.7 11.23,80.45 12.23,80.45 IC4.19 12.48,80.2 13.48,80.2 18.86,74.82 34.86,74.82 36.22,73.45 38.97,73.45 39.97,74.45 44.97,74.45 44.97,71.7 46.22,70.45 52.22,70.45 53.97,72.2 IC1.6
37EXWR  (via drill 0.35)
  Top 0.3: 15.48,64.45 15.48,71.02 v14.59,71.91 | 15.48,64.45 15.48,55.33 v15.56,55.24 | IC2.11 12.48,29.7 14.48,31.7 14.48,36.88 15.29,37.7 15.29,46.12 15.84,46.66 15.84,51.58 15.61,51.81 15.61,52.37 16.01,52.77 16.57,52.77 17.27,52.07 v18.1,52.07 | 15.48,64.45 v15.23,64.45 | v64.77,65.09 63.18,63.5 v62.86,63.5
  Bottom 0.3: v14.59,71.91 14.89,72.2 19.23,72.2 IC11.8 | v15.23,64.45 15.87,64.45 16.67,65.25 18.89,65.25 19.98,64.16 32.9,64.16 33.19,64.45 40.97,64.45 43.47,66.95 48.89,66.95 49.89,67.94 52.39,67.94 53.38,66.95 54.47,66.95 55.72,65.7 60.66,65.7 v62.86,63.5 | IC5.11 v64.77,65.09 | v18.1,52.07 17.12,53.05 16.63,53.05 15.56,54.12 v15.56,55.24
37EXWR_OUTPUT_ENABLE_  (via drill 0.35)
  Top 0.3: v5.86,56.36 5.86,53.34 4.98,52.45 IC2.1 | v18.77,67.25 18.4,67.61 18.4,73.45 23.23,78.27 v23.23,81.77
  Bottom 0.3: v5.86,56.36 5.86,56.68 10.23,61.04 10.23,63.06 11.27,64.11 13.57,64.11 14.13,64.67 14.13,65.09 14.72,65.67 15.45,65.67 17.02,67.25 v18.77,67.25 | v23.23,81.77 23.66,82.2 58.47,82.2 72.23,68.45 72.23,67.95 IC5.8
A0  (via drill 0.35)
  Top 0.3: v19.09,35.73 19.09,38.59 17.23,40.45 B5.HV1 | v33.61,35.57 35.22,37.18 v35.22,41.7 | v49.72,45.59 49.47,45.84 49.47,55.66 v48.03,57.09 | v20.09,61.95 20.09,63.22 17.54,65.77 v17.54,90.39
  Bottom 0.3: v33.61,35.57 19.25,35.57 v19.09,35.73 | v35.22,41.7 35.97,42.45 39.13,42.45 40.29,43.62 40.29,44.59 41.27,45.57 49.71,45.57 v49.72,45.59 | v48.03,57.09 45.24,59.88 43.79,59.88 41.43,62.25 35.24,62.25 34.75,61.75 27.62,61.75 27.15,62.23 27.15,62.25 20.39,62.25 v20.09,61.95 | v17.54,90.39 9.73,98.2 9.73,98.7 J1_ADDRESS_CON.1
A0_LV
  Top 0.3: U$2.35/A16 18.23,10.95 17.76,11.41 17.76,24.66 16.98,25.45 16.98,30.45 B5.LV1
A1  (via drill 0.35)
  Top 0.3: v18.61,61.07 18.61,61.38 15.98,64.02 15.98,95.54 12.77,98.74 J1_ADDRESS_CON.2
  Bottom 0.3: v18.61,61.07 18.61,59 20.75,56.86 25.72,56.86 26.86,55.72 27.79,55.72 29.22,54.29 B6.HV4
A1_LV  (via drill 0.35)
  Top 0.3: v10.29,19.57 9.98,19.57 8.23,21.32 8.23,37.95 7.48,38.7 7.48,45.77 7.66,45.95 v7.66,46.11 | v23.13,46.91 23.84,46.2 27.78,46.2 B6.LV4
  Bottom 0.3: v10.29,19.57 10.61,19.25 12.43,19.25 20.73,10.95 U$2.36/A17 | v7.66,46.11 8.25,46.7 10.79,46.7 11.23,46.27 14.92,46.27 15.24,46.59 15.24,46.67 16.74,46.67 17.14,46.27 22.5,46.27 v23.13,46.91
A2  (via drill 0.35)
  Top 0.3: v33.47,63.77 33.47,59.7 IC7.13 | v17.98,63.7 16.48,65.2 16.48,96.7 14.73,98.45 14.73,98.7 J1_ADDRESS_CON.3
  Bottom 0.3: v33.47,63.77 33.41,63.7 v17.98,63.7
A3  (via drill 0.35)
  Top 0.3: IC7.3 35.97,67.45 35.97,81.2 34.22,82.95 21.99,82.95 v21.91,82.87 | J1_ADDRESS_CON.4 17.23,98.7 17.23,98.45 18.73,96.95 18.73,82.95 18.81,82.87 v19.37,82.87
  Bottom 0.3: v19.37,82.87 v21.91,82.87
A5
  Top 0.3: IC3.1 23.98,85.2 22.48,86.7 22.48,98.45 22.23,98.7 J1_ADDRESS_CON.6
A6
  Top 0.3: IC3.2 26.48,85.2 25.48,86.2 25.48,97.95 24.98,98.45 24.98,98.7 J1_ADDRESS_CON.7
A7  (via drill 0.35)
  Top 0.3: IC3.3 28.98,85.2 27.98,86.2 27.98,94.9 v27.94,94.93 | v27.94,97.16 27.3,97.79 J1_ADDRESS_CON.8
  Bottom 0.3: v27.94,97.16 v27.94,94.93
A8
  Top 0.3: IC3.4 31.72,85.2 30.48,86.45 30.48,97.95 29.98,98.45 29.98,98.7 J1_ADDRESS_CON.9
A9
  Top 0.3: IC3.5 34.22,85.2 32.97,86.45 32.97,97.95 32.47,98.45 32.47,98.7 J1_ADDRESS_CON.10
A10
  Top 0.3: IC3.6 36.72,85.2 35.47,86.45 35.47,98.2 34.97,98.7 J1_ADDRESS_CON.11
A11
  Top 0.3: IC6.13 77.48,82.95 73.98,79.45 62.47,79.45 60.47,77.45 56.97,77.45 54.97,79.45 54.97,93.14 42.79,93.14 37.47,98.45 J1_ADDRESS_CON.12
A12
  Bottom 0.3: IC3.11 31.97,92.95 31.97,94.61 34.29,96.93 34.29,96.95 37.97,96.95 39.72,98.7 39.97,98.7 J1_ADDRESS_CON.13
A13
  Bottom 0.3: IC3.12 29.23,92.7 31.23,90.7 32.22,90.7 33.29,91.77 33.29,94.3 34.81,95.82 39.34,95.82 42.22,98.7 42.47,98.7 J1_ADDRESS_CON.14
A14
  Bottom 0.3: J1_ADDRESS_CON.15 41.28,94.93 38.1,94.93 38.1,89.22 44.63,82.68 64.9,82.68 70.17,87.95 IC6.2
A15  (via drill 0.35)
  Top 0.3: IC6.3 66.33,89.56 65.21,89.56 64.48,90.29 64.48,91.41 63.79,92.1 62.67,92.1 61.94,92.83 61.94,93.95 61.24,94.66 54.34,94.66 53.94,94.25 53.06,94.25 51.74,95.57 v47.63,95.57
  Bottom 0.3: J1_ADDRESS_CON.16 v47.63,95.57
D0  (via drill 0.35)
  Top 0.3: 6.48,47.31 6.48,47.99 6.29,48.17 6.29,48.77 6.82,49.3 6.82,56.88 5.74,57.95 v4.79,57.95 | 6.48,47.31 6.48,39.34 5.75,38.61 3.5,38.61 2.72,37.84 2.72,28.42 3.49,27.65 3.49,23.35 9.23,17.61 9.23,3.95 9.48,3.7 J2_DATA_AND_POWER_CON.20 | IC2.3 6.48,47.31
  Bottom 0.3: v4.79,57.95 3.22,57.95 2.22,58.95 2.22,70.2 3.16,71.14 6.16,71.14 7.73,72.7 12.23,72.7 IC4.16
D0_HV  (via drill 0.35)
  Top 0.3: IC4.4 4.98,75.2 6.73,73.45 6.73,64.57 8.77,62.52 8.77,58.59 v8.48,58.29 8.54,58.29 8.77,58.06 8.77,49.66 v8.79,49.63 | v60.29,57.88 63.73,54.45 B3.HV4
  Bottom 0.3: v8.79,49.63 4.98,49.63 IC2.2 | v60.29,57.88 49.05,57.88 45.66,61.28 43.9,61.28 41.99,63.18 34.45,63.18 33.97,62.7 17.98,62.7 17.45,62.18 17.45,61.26 17.46,61.25 17.46,59.37 16.83,58.74 8.92,58.74 v8.48,58.29
D0_LV  (via drill 0.35)
  Top 0.3: v53.79,15.45 53.72,15.52 53.72,23.7 55.47,25.45 55.47,27.45 57.47,29.45 57.47,31.23 62.91,36.66 v63.38,36.66 | B3.LV4 63.82,43.09 v62.43,41.7
  Bottom 0.3: v53.79,15.45 48.47,15.45 43.97,10.95 U$2.15/A1 | v63.38,36.66 64.18,36.66 66.47,38.94 66.47,40.53 65.09,41.91 62.64,41.91 v62.43,41.7
D1  (via drill 0.35)
  Top 0.3: v9.48,64.7 9.73,64.45 9.73,50.8 10.31,50.22 10.31,46.6 9.73,46.02 9.73,45.7 8.66,44.63 v8.5,44.63 8.5,42.25 8.23,41.98 v8.23,38.95 | J2_DATA_AND_POWER_CON.19 11.98,3.7 10.23,5.45 10.23,18 6.99,21.24 6.99,33.57 7.18,33.77 7.18,37.41 v7.48,37.7
  Bottom 0.3: v9.48,64.7 12.23,67.45 IC4.14 | v7.48,37.7 8.23,38.45 v8.23,38.95 | IC2.4 8.5,44.77 v8.5,44.63
D1_HV  (via drill 0.35)
  Top 0.3: v3.47,58.7 3.79,58.38 v3.79,53.93 | B3.HV3 61.22,54.45 57.79,57.88 54.29,57.88 v43.11,69.07
  Bottom 0.3: v3.79,53.93 3.47,53.61 2.72,53.61 2.72,44.45 4.73,42.45 IC2.5 | v3.47,58.7 3.47,58.86 2.72,59.61 2.72,70.03 2.86,70.17 IC4.6 4.98,70.2 6.93,70.2 7.86,71.14 13.57,71.14 14.5,70.2 39.53,70.2 40.06,69.67 41.11,69.67 41.51,70.07 42.07,70.07 42.08,70.06 42.12,70.06 v43.11,69.07
D1_LV  (via drill 0.35)
  Top 0.3: v65.38,11.95 66.45,13.03 66.45,24.23 65.23,25.45 65.23,26.67 64.61,27.28 64.61,28.25 65.25,28.89 65.25,34.98 67.13,36.86 67.13,45.58 v67.29,45.74
  Bottom 0.3: v67.29,45.74 67.25,45.7 62.72,45.7 61.22,44.2 B3.LV3 | U$2.22/A8 62.23,10.79 63.39,11.95 v65.38,11.95
D2  (via drill 0.35)
  Top 0.3: v10.29,20.89 10.61,20.89 11.48,20.02 11.48,6.95 14.48,3.95 14.48,3.7 J2_DATA_AND_POWER_CON.18 | v9.48,43.95 9.73,43.7 9.73,37.38 v9.48,37.13 | IC4.18 12.23,77.7 8.73,74.2 8.73,64.27 9.23,63.77 9.23,50.64 9.84,50.02 9.84,46.82 v8.98,45.95
  Bottom 0.3: 7.13,34.79 9.73,32.2 9.73,20.89 v10.29,20.89 | 7.13,34.79 4.98,36.95 IC2.7 | v8.98,45.95 9.73,45.2 9.73,43.95 v9.48,43.95 | 7.13,34.79 v9.48,37.13
D2_HV  (via drill 0.35)
  Top 0.3: 2.72,50.95 2.72,71.2 2.97,71.45 2.97,71.95 2.72,72.2 2.72,78.7 4.23,80.2 4.73,80.2 IC4.2 | 2.72,50.95 2.72,41.7 4.73,39.7 IC2.6 | v50.97,50.7 50.97,51.7 53.47,54.2 B3.HV2 | 2.72,50.95 v3.47,50.95 | v23.81,51.12 v28.57,51.12
  Bottom 0.3: v3.47,50.95 23.65,50.95 v23.81,51.12 | v50.97,50.7 28.99,50.7 v28.57,51.12
D2_LV  (via drill 0.35)
  Top 0.3: v69.57,24.39 67.32,22.14 67.32,11.62 67.71,11.22 67.71,10.37 67.11,9.76 66.24,9.76 65.64,10.37 65.64,10.48 65.32,10.79 U$2.23/A9 | v58.96,36.07 58.96,36.38 57.47,37.87 57.47,41.2 56.22,42.45 55.34,42.45 B3.LV2 | v68.79,28.39 68.79,28.83 68.29,29.33 68.29,32.39 v67.98,32.7
  Bottom 0.3: v69.57,24.39 70.63,25.45 70.63,26.54 v68.79,28.39 | v67.98,32.7 66.51,34.16 61.18,34.16 59.11,36.23 v58.96,36.07
D3  (via drill 0.35)
  Top 0.3: v13.48,8.45 16.98,4.95 16.98,3.7 J2_DATA_AND_POWER_CON.17 | v16.48,60.3 17.43,60.3 17.77,59.95 v20.73,59.95 | v48.07,51.61 48.23,51.61 48.47,51.37 48.47,29.95 47.28,28.76 46.54,28.76 44.97,27.2 44.97,24.2 32.22,11.45 v32.22,8.68
  Bottom 0.3: IC2.8 4.98,34.45 9.23,30.2 9.23,12.7 v13.48,8.45 31.99,8.45 v32.22,8.68 | v16.48,60.3 14.63,60.3 12.48,62.45 IC4.12 | v20.73,59.95 23,57.68 26.14,57.68 27.3,56.52 28.16,56.52 28.8,55.88 30.96,55.88 31.85,54.98 31.85,54.08 34.32,51.61 v48.07,51.61
D3_HV  (via drill 0.35)
  Top 0.3: IC2.9 4.98,32.2 6.73,33.95 6.73,38.07 6.98,38.32 v6.98,48.45 7.27,48.75 7.27,57.15 6.5,57.92 6.5,63.61 5.16,64.95 4.98,64.95 IC4.8 | v50.22,48.57 50.22,53.45 50.97,54.2 B3.HV1 | v23.81,48.58 v28.89,48.58
  Bottom 0.3: v50.22,48.57 50.11,48.45 29.02,48.45 v28.89,48.58 | v6.98,48.45 23.69,48.45 v23.81,48.58
D3_LV
  Top 0.3: U$2.9/CS 46.34,26.05 46.34,26.32 48.97,28.95 48.97,41.7 50.97,43.7 50.97,43.95 B3.LV1
D4  (via drill 0.35)
  Top 0.3: v10.48,22.2 11.98,20.7 11.98,10.2 12.65,9.53 15.24,9.53 18.73,6.03 18.73,4.45 J2_DATA_AND_POWER_CON.16 | v7.66,69.11 7.66,75.02 4.98,77.7 IC4.3 | v26.29,42.2 29.73,42.2 31.23,43.7 31.23,56.41 29.56,58.07 28.18,58.07 27.61,58.63 27.61,68.37 27.62,68.38 27.62,68.58 27.23,68.98 v27.23,69.02 | v22.73,38.95 22.7,38.98 22.7,36.97 v22.04,36.32
  Bottom 0.3: v10.48,22.2 10.23,22.2 10.23,32.13 12.23,34.13 12.23,34.45 IC2.13 12.48,34.7 15.11,34.7 17.2,36.79 21.57,36.79 v22.04,36.32 | v7.66,69.11 7.82,68.95 13.9,68.95 14.15,69.2 27.04,69.2 v27.23,69.02 | v26.29,42.2 26.04,41.95 24.23,41.95 23.48,41.2 23.48,39.95 22.73,39.2 v22.73,38.95
D4_HV  (via drill 0.35)
  Top 0.3: IC4.17 12.23,75.2 12.23,74.95 10.23,72.95 10.23,51.12 10.76,50.58 10.76,46.41 10.23,45.88 10.23,35.4 9.91,35.08 v9.84,35.08 | B4.HV4 63.6,40.64 60.41,37.45 v60.02,37.45 | IC2.12 11.91,32.07 v10.48,33.5
  Bottom 0.3: v60.02,37.45 59.71,37.13 54.38,37.13 51.95,34.7 34.77,34.7 34.51,34.45 32.8,34.45 32.54,34.7 18.64,34.7 18.1,35.24 17.14,35.24 16.61,34.71 16.61,34.7 14.11,32.2 12.48,32.2 IC2.12 | v9.84,35.08 10.48,34.45 v10.48,33.5
D4_LV
  Bottom 0.3: U$2.10/CS 43.97,26.2 45.47,27.7 53.1,27.7 53.9,28.5 56.16,28.5 56.36,28.7 61.72,28.7 63.47,30.45 63.73,30.45 B4.LV4
D5  (via drill 0.35)
  Top 0.3: v19.73,15.7 19.73,6.2 22.23,3.7 J2_DATA_AND_POWER_CON.15 | IC2.18 10.68,45.6 10.68,34.81 9.68,33.81 9.68,25.74 10.98,24.45 v11.13,24.45 | v7.84,47.45 7.73,47.57 7.73,57.47 6.96,58.23 6.96,60.71 v7.41,61.16
  Bottom 0.3: v7.84,47.45 12.23,47.45 IC2.18 | IC4.9 4.98,62.45 6.74,62.45 7.41,61.79 v7.41,61.16 | v19.73,15.7 11.13,24.29 v11.13,24.45
D5_HV  (via drill 0.35)
  Top 0.3: IC2.19 12.23,49.95 10.73,51.45 10.73,57.7 12.23,59.2 12.23,59.95 IC4.11 | v57.62,49.63 57.47,49.49 57.47,43.64 58.22,42.89 58.3,42.89 58.74,42.45 59.47,42.45 61.22,40.7 B4.HV3 | v22.54,49.85 v26.99,49.85
  Bottom 0.3: IC2.19 v22.54,49.85 | v57.62,49.63 26.99,49.63 v26.99,49.85
D5_LV  (via drill 0.35)
  Top 0.3: v53.09,28.7 51.59,28.7 50.22,27.34 50.22,25.2 38.77,13.75 38.77,10.82 U$2.13/SCK
  Bottom 0.3: v53.09,28.7 53.34,28.95 55.97,28.95 56.22,29.2 59.72,29.2 60.97,30.45 61.22,30.45 B4.LV3
D6  (via drill 0.35)
  Top 0.3: J2_DATA_AND_POWER_CON.14 24.98,3.7 24.98,4.7 27.23,6.95 27.23,13.79 26.18,14.84 25.6,14.84 25,15.45 25,16.02 22.07,18.95 22.07,27.66 20.98,28.75 20.98,32.2 18.1,35.08 18.1,37.93 15.9,40.12 15.9,45.44 v15.98,45.51 v15.98,45.52 16.29,45.84 v16.29,52.09
  Bottom 0.3: v15.98,45.52 15.34,44.88 12.44,44.88 IC2.17 | v16.29,52.09 16.26,52.12 14.81,52.12 12.67,54.26 12.67,55.12 12.34,55.45 10.84,55.45 10.41,55.88 6.82,55.88 6.14,55.2 5.26,55.2 4.54,55.92 4.54,56.52 8.41,60.38 8.41,62.71 7.62,63.49 7.62,64.77 IC4.7
D6_HV  (via drill 0.35)
  Top 0.3: IC4.13 12.48,64.95 14.48,62.95 14.48,59.45 12.98,57.95 12.98,55.95 12.48,55.45 12.48,53.88 12.7,53.66 13.65,53.66 14.48,52.84 14.48,42.23 | v52.11,37.13 52.11,39.09 53.47,40.45 B4.HV2 | 14.48,42.23 v14.48,38.2 | IC2.16 14.48,42.23
  Bottom 0.3: v52.11,37.13 50.88,35.91 34.87,35.91 34.12,36.66 22.86,36.66 22.39,37.12 22.36,37.12 21.85,37.63 15.04,37.63 v14.48,38.2
D6_LV
  Bottom 0.3: U$2.11/MOSI 41.47,26.2 43.47,28.2 51.22,28.2 53.47,30.45 B4.LV2
D7  (via drill 0.35)
  Top 0.3: v1.75,71.7 1.91,71.54 1.91,40.32 | 1.91,40.32 1.91,27.94 2.22,27.62 2.22,16.75 4.95,14.03 v4.95,13.39 | v2.57,40.38 2.5,40.32 1.91,40.32
  Bottom 0.3: v1.75,71.7 2.5,72.45 4.48,72.45 4.73,72.7 IC4.5 | v2.57,40.38 3.13,40.95 7.23,40.95 11.23,36.95 12.23,36.95 IC2.14 | v4.95,13.39 5.58,13.39 13.04,5.93 24.99,5.93 27.23,3.7 J2_DATA_AND_POWER_CON.13
D7_HV  (via drill 0.35)
  Top 0.3: v50.47,37.45 50.47,39.7 50.97,40.2 50.97,40.45 B4.HV1 | v41.79,69.39 42.97,68.2 42.97,60.2 48.97,54.2 48.97,44.16 v49.22,43.91
  Bottom 0.3: IC2.15 12.48,39.45 15.4,39.45 16.22,38.63 22.04,38.63 23.14,37.54 34.36,37.54 34.92,36.98 50,36.98 v50.47,37.45 | v49.22,43.91 50.97,42.16 50.97,40.7 B4.HV1 | IC4.15 12.48,69.95 13.98,69.95 14.23,69.7 39.37,69.7 39.86,69.22 41.62,69.22 v41.79,69.39
D7_LV
  Bottom 0.3: U$2.12/MISO 38.97,26.2 41.47,28.7 48.97,28.7 50.72,30.45 50.97,30.45 B4.LV1
FLIPFLOP_CLR  (via drill 0.35)
  Top 0.3: 59.47,63.2 59.47,67.7 IC5.13 | 59.47,63.2 59.47,62.7 57.22,60.45 IC5.1 | v64.48,38.95 65.73,40.2 65.73,54.45 60.97,59.2 60.97,61.7 59.47,63.2
  Bottom 0.3: v64.48,38.95 64.48,39.03 64.3,39.2 35.22,39.2 33.97,40.45 B2.HV1
FLIPFLOP_CLR_LV
  Top 0.3: U$2.25 31.23,26.2 33.88,28.86 33.88,30.47 B2.LV1
FLIPFLOP_PRE
  Top 0.3: IC5.4 64.98,60.45 67.23,62.7 67.23,67.7 IC5.10
  Bottom 0.3: B1.HV1 33.97,54.2 35.72,52.45 46.97,52.45 51.02,56.5 60.77,56.5 64.48,60.2 64.73,60.2 IC5.4
FLIPFLOP_PRE_LV  (via drill 0.35)
  Top 0.3: v31.11,27.95 31.43,27.95 32.22,28.75 32.22,41.45 33.72,42.95 33.72,43.95 B1.LV1
  Bottom 0.3: v31.11,27.95 30.86,28.2 24.98,28.2 24.48,27.7 23.23,27.7 22.48,26.95 21.73,26.95 20.98,26.2 U$2.29
GND
  pour Top: 0,0 79.38,0 80.65,1.27 80.65,100.97 0,100.97
INT0*  (via drill 0.35)
  Top 0.3: v31.23,21.45 27.48,25.2 27.48,27.45 25.48,27.45 23.48,29.45 23.48,30.99 20.16,34.3 20.16,40.02 19.73,40.45 B5.HV2
  Bottom 0.3: v31.23,21.45 69.98,21.45 75.56,27.04 75.56,87 73.66,88.9 73.66,92.39 70.17,95.89 60.96,95.89 60.96,95.74 59.08,93.86 59.08,86.97 J1-INTERRUPTS.1
INTERUPT_TO_TRS80_LV_  (via drill 0.35)
  Top 0.3: v19.91,24.39 19.48,24.82 19.48,30.45 B5.LV2
  Bottom 0.3: v19.91,24.39 24.76,24.39 24.76,24.45 25.08,24.77 26.44,24.77 27.57,23.64 47.63,23.64 48.97,24.98 48.97,25.95 U$2.8
LED_BLUE  (via drill 0.35)
  Top 0.3: U$2.4/CANRX 59.22,25.95 59.22,22.2 57.47,20.45 57.47,20.17 57.66,19.98 57.66,19.42 57.47,19.23 57.47,11.31 57.55,11.22 57.55,10.37 57.47,10.28 57.47,9.57 v57.84,9.2
  Bottom 0.3: v57.84,9.2 60.72,9.2 61.47,8.45 R4.1
LED_GREEN
  Top 0.3: R5.1 61.47,3.7 60.22,4.95 60.22,20.7 61.47,21.95 61.47,25.95 U$2.3/CANTX
LED_RED
  Top 0.3: U$2.2 63.91,25.81 63.91,21.89 62.72,20.7 62.72,6.95 61.72,5.95 R6.1
N$1
  Bottom 0.3: U$2.3V3_LO 66.68,12.38 65.72,13.34 U$2.AREF
N$2
  Bottom 0.3: R5.2 64.23,3.7 64.98,4.45 67.73,4.45 RGB_LED2.2
N$19
  Top 0.3: R4.2 64.23,8.2 66.23,6.2 RGB_LED2.1
N$21
  Top 0.3: R6.2 64.23,5.7 66.98,2.95 70.73,2.95 70.73,4.2 RGB_LED2.4
NOTHING1_LV  (via drill 0.35)
  Top 0.3: v19.18,19.14 19.49,18.82 19.49,17.43 25.98,10.95 U$2.38/A19 | v23.48,32.45 20.98,34.95 20.98,42.75 19.63,44.09 B6.LV2
  Bottom 0.3: v19.18,19.14 18.86,19.14 14.73,23.27 14.73,27.74 15.87,28.89 19.92,28.89 20.98,29.95 20.98,31.11 22.31,32.45 v23.48,32.45
NOTHING2_LV  (via drill 0.35)
  Top 0.3: v11.34,26.61 11.34,26.7 12.53,26.7 12.9,27.07 13.72,27.07 14.98,28.32 14.98,36.2 v15.23,36.45
  Bottom 0.3: U$2.39/A20 28.48,10.95 27.48,11.95 24.73,11.95 20.96,15.72 20.96,16.83 19.96,17.82 18.9,17.82 13.26,23.46 13.26,24.21 11.34,26.12 v11.34,26.61 | B6.LV1 16.98,43.95 16.73,43.95 16.54,43.77 10.75,43.77 9.84,42.86 7.94,42.86 7.62,42.55 7.62,41.31 10.82,38.11 13.44,38.11 15.1,36.45 v15.23,36.45
P0  (via drill 0.35)
  Top 0.3: v65.98,27.7 66.23,27.95 66.23,34.7 67.98,36.45 67.98,38.2 69.48,39.7 69.48,39.95 J1_TEENSY_CON.7
  Bottom 0.3: v65.98,27.7 67.48,27.7 68.98,26.2 U$2.0/RX
P1
  Top 0.3: U$2.1/TX 66.73,26.09 66.73,34.45 69.48,37.2 69.48,37.45 J1_TEENSY_CON.9
P5  (via drill 0.35)
  Top 0.3: v67.48,28.7 67.23,28.95 67.23,33.75 68.18,34.7 69.48,34.7 J1_TEENSY_CON.11
  Bottom 0.3: v67.48,28.7 65.66,28.7 64.66,27.7 58.22,27.7 56.72,26.2 U$2.5
P6
  Bottom 0.3: U$2.6 53.97,26.2 54.97,27.2 55.72,27.2 56.72,28.2 64.48,28.2 68.73,32.45 69.48,32.45 J1_TEENSY_CON.13
P7  (via drill 0.35)
  Top 0.3: J1_TEENSY_CON.15 69.73,29.7 69.73,28.14 68.18,26.59 68.18,25.09 v67.54,24.45
  Bottom 0.3: v67.54,24.45 52.97,24.45 51.47,25.95 U$2.7
P14  (via drill 0.35)
  Top 0.3: v68.86,17.34 70.95,19.43 70.95,25.37 70.72,25.61 70.72,26.46 70.95,26.7 v70.95,28.18
  Bottom 0.3: v68.86,17.34 68.04,16.52 47.04,16.52 41.47,10.95 U$2.14/A0 | v70.95,28.18 70.98,28.2 72.73,28.2 73.73,29.2 73.73,46.95 72.98,46.95 72.48,47.45 72.23,47.45 J1_TEENSY_CON.2
P16  (via drill 0.35)
  Top 0.3: J1_TEENSY_CON.4 72.23,44.95 72.23,44.7 78.26,38.66 78.26,23.65 77.15,22.54 77.15,19.86 v72.99,15.7
  Bottom 0.3: v72.99,15.7 56.26,15.7 54.94,14.38 49.91,14.38 46.47,10.95 U$2.16/A2
P17  (via drill 0.35)
  Top 0.3: v50.27,17.45 50.27,12.25 48.97,10.95 U$2.17/A3 | v77.09,24.59 77.18,24.68 77.18,37.25 72.23,42.2 72.23,42.45 J1_TEENSY_CON.6
  Bottom 0.3: v50.27,17.45 57.72,17.45 58.72,18.45 71.74,18.45 77.09,23.79 v77.09,24.59
P18  (via drill 0.35)
  Top 0.3: v51.34,19.02 51.66,19.02 51.66,11.13 51.47,10.95 U$2.18/A4/SDA | v75.29,23.73 76.04,24.48 76.04,36.38 72.23,40.2 J1_TEENSY_CON.8
  Bottom 0.3: v51.34,19.02 56.26,19.02 56.65,18.64 57.41,18.64 58.22,19.45 69.48,19.45 72.73,22.7 74.27,22.7 v75.29,23.73
P19  (via drill 0.35)
  Top 0.3: v56.97,19.7 56.97,13.95 53.97,10.95 U$2.19/A5/SCL | v74.98,25.2 74.73,25.45 74.73,30.95 74.23,31.45 74.23,35.7 72.23,37.7 J1_TEENSY_CON.10
  Bottom 0.3: v56.97,19.7 57.72,20.45 69.73,20.45 72.73,23.45 73.23,23.45 v74.98,25.2
P20  (via drill 0.35)
  Top 0.3: v70.61,14.95 74.23,18.57 74.23,30.7 73.73,31.2 73.73,32.95 72.23,34.45 72.23,34.7 J1_TEENSY_CON.12
  Bottom 0.3: U$2.20/A6 56.72,10.95 57.97,12.2 59.47,12.2 60.22,12.95 60.22,13.65 61.68,15.11 70.45,15.11 v70.61,14.95
P21  (via drill 0.35)
  Top 0.3: v68.07,14.36 73.73,20.02 73.73,30.45 72.23,31.95 72.23,32.2 J1_TEENSY_CON.14
  Bottom 0.3: v68.07,14.36 67.59,14.36 67.34,14.61 63.94,14.61 63.1,13.77 63.1,13.32 61.97,12.2 60.47,12.2 59.22,10.95 U$2.21/A7
P24  (via drill 0.35)
  Top 0.3: v39.45,20.2 39.45,20.23 33.72,25.95 U$2.24 | v72.98,21.95 73.23,22.2 73.23,28.45 72.23,29.45 72.23,29.7 J1_TEENSY_CON.16
  Bottom 0.3: v39.45,20.2 41.45,18.2 50.68,18.2 50.93,17.95 57.47,17.95 58.47,18.95 69.98,18.95 v72.98,21.95
RAS*  (via drill 0.35)
  Top 0.3: v51.97,23.95 40.22,12.2 40.22,10.13 35.04,4.95 35.04,3.61 J2_DATA_AND_POWER_CON.10
  Bottom 0.3: v51.97,23.95 66.48,23.95 67.2,23.23 70.13,23.23 71.68,24.77 72.07,24.77 73.1,25.8 73.1,26.94 74.48,28.32 74.48,86.45 70.48,90.45 IC6.1
RD  (via drill 0.35)
  Top 0.3: v46.31,69.11 44.97,70.45 44.97,74.95 48.72,78.7 48.72,79.95 IC1.11
  Bottom 0.3: v46.31,69.11 45.14,67.94 41.91,67.94 IC7.1
RD*  (via drill 0.35)
  Top 0.3: IC1.13 43.97,79.95 46.22,79.95 IC1.12 47.31,80.96 v47.31,87.63 | J1_ADDRESS_CON.19 55.24,97.47 v53.34,95.57
  Bottom 0.3: v47.31,87.63 53.34,93.66 v53.34,95.57
SYSRES*  (via drill 0.35)
  Top 0.3: v11.82,56.59 11.63,56.41 11.63,54.61 v11.48,54.45 | v17.14,56.52 v19.37,56.52 | v3.81,17.78 v5.71,15.88
  Bottom 0.3: B6.HV3 27.07,54.29 25.41,55.95 19.93,55.95 v19.37,56.52 | J2_DATA_AND_POWER_CON.8 39.97,3.7 39.47,3.7 36.11,7.07 13.54,7.07 5.71,14.89 v5.71,15.88 | v17.14,56.52 16.9,56.27 12.07,56.27 11.82,56.52 v11.82,56.59 | v11.48,54.45 11.23,54.2 5.17,54.2 4.45,54.93 2.38,54.93 1.82,54.36 1.82,19.77 v3.81,17.78
SYSRES_LV  (via drill 0.35)
  Top 0.3: v8.98,41.59 8.98,38.7 8.73,38.45 8.73,25.41 12.11,22.02 v12.24,22.02
  Bottom 0.3: U$2.37/A18 23.47,10.79 20.15,14.12 19.22,14.12 17.94,15.4 17.94,16.33 v12.24,22.02 | B6.LV3 27.23,43.95 26.73,43.95 25.23,42.45 15.74,42.45 14.55,41.27 11.32,41.27 10.9,41.69 9.08,41.69 v8.98,41.59
VCC
  pour Bottom: -0.32,-0.32 80.65,-0.32 80.65,100.65 -0.32,100.65
VCC/2  (via drill 0.35)
  Top 0.3: B5.LV 22.24,30.48 22.48,30.25 22.48,29.2 24.73,26.95 24.73,22.45 25.98,21.2 U$2.3V3_2 | J2_DATA_AND_POWER_CON.3 52.47,3.7 52.47,11.2 52.72,11.45 52.72,26.7 55.97,29.95 55.97,30.45 B4.LV 56.22,30.7 56.47,30.95 56.47,31.7 62.47,37.7 v66.23,37.7 | v51.43,47.31 v56.2,47.31 | v39.05,47.31 v36.51,47.31
  Bottom 0.3: 65.19,42.45 69.48,42.45 J1_TEENSY_CON.5 | 65.19,42.45 57.72,42.45 56.22,43.95 B3.LV v56.2,47.31 | B6.LV 22.79,44.13 25.96,47.31 v36.51,47.31 | 37.97,31.7 37.47,32.2 24.23,32.2 22.73,30.7 22.23,30.7 B5.LV | 37.97,31.7 38.97,30.7 B2.LV | 37.97,31.7 38.47,32.2 54.22,32.2 55.72,30.7 55.97,30.7 B4.LV | B1.LV v39.05,47.31 v51.43,47.31 | v66.23,37.7 66.23,38.06 66.93,38.77 66.93,40.71 65.19,42.45
WAIT0*  (via drill 0.35)
  Top 0.3: J2-WAITS.1 60.95,80.95 v58.47,80.95
  Bottom 0.3: v58.47,80.95 58.97,80.95 68.48,71.45 68.48,61.45 69.48,60.45 IC5.6
WR*  (via drill 0.35)
  Top 0.3: IC7.15 38.97,59.7 39.97,60.7 39.97,69.2 41.22,70.45 43.47,70.45 49.16,64.77 51.75,64.77 59.69,72.71 v59.69,75.25 | v59.69,78.74 59.69,78.78 57.79,80.67 57.79,82.54 v55.88,84.45
  Bottom 0.3: v59.69,78.74 v59.69,75.25 | J1_ADDRESS_CON.20 57.78,96.69 55.91,94.81 55.91,84.48 v55.88,84.45
XX11X111111XXXX  (via drill 0.35)
  Top 0.3: v72.07,91.76 73.34,91.76 v75.56,89.53
  Bottom 0.3: IC3.8 39.47,92.45 44.97,92.45 44.97,83.14 62.35,83.14 64.48,85.27 64.48,86.24 65.26,87.02 66.24,87.02 68.54,89.33 68.54,91.2 69.11,91.77 v72.06,91.77 v72.07,91.76 | IC6.14 77.79,87 77.48,87.3 76.73,87.3 76.16,87.87 76.16,88.62 75.56,89.22 v75.56,89.53

### Text on the board
tNames: wr* | INT* | WAIT* | a0 | a1 | 74LS30 | 74LS20 | 74LS00 | 74LS244 | 74LS139 | 74LS74 | 74LS155 | 74LS373 | TRS80MXS Floppy V1.0 / Joe Rounceville (C)2019 | d1 | d3 | d5 | d7 | gnd | d0 | d2 | d4 | d6 | 3.3v | 5v